# EAGLE design LoraGateway (EAGLE 9.5.1)

## Sheet 1 of 2: Baseband
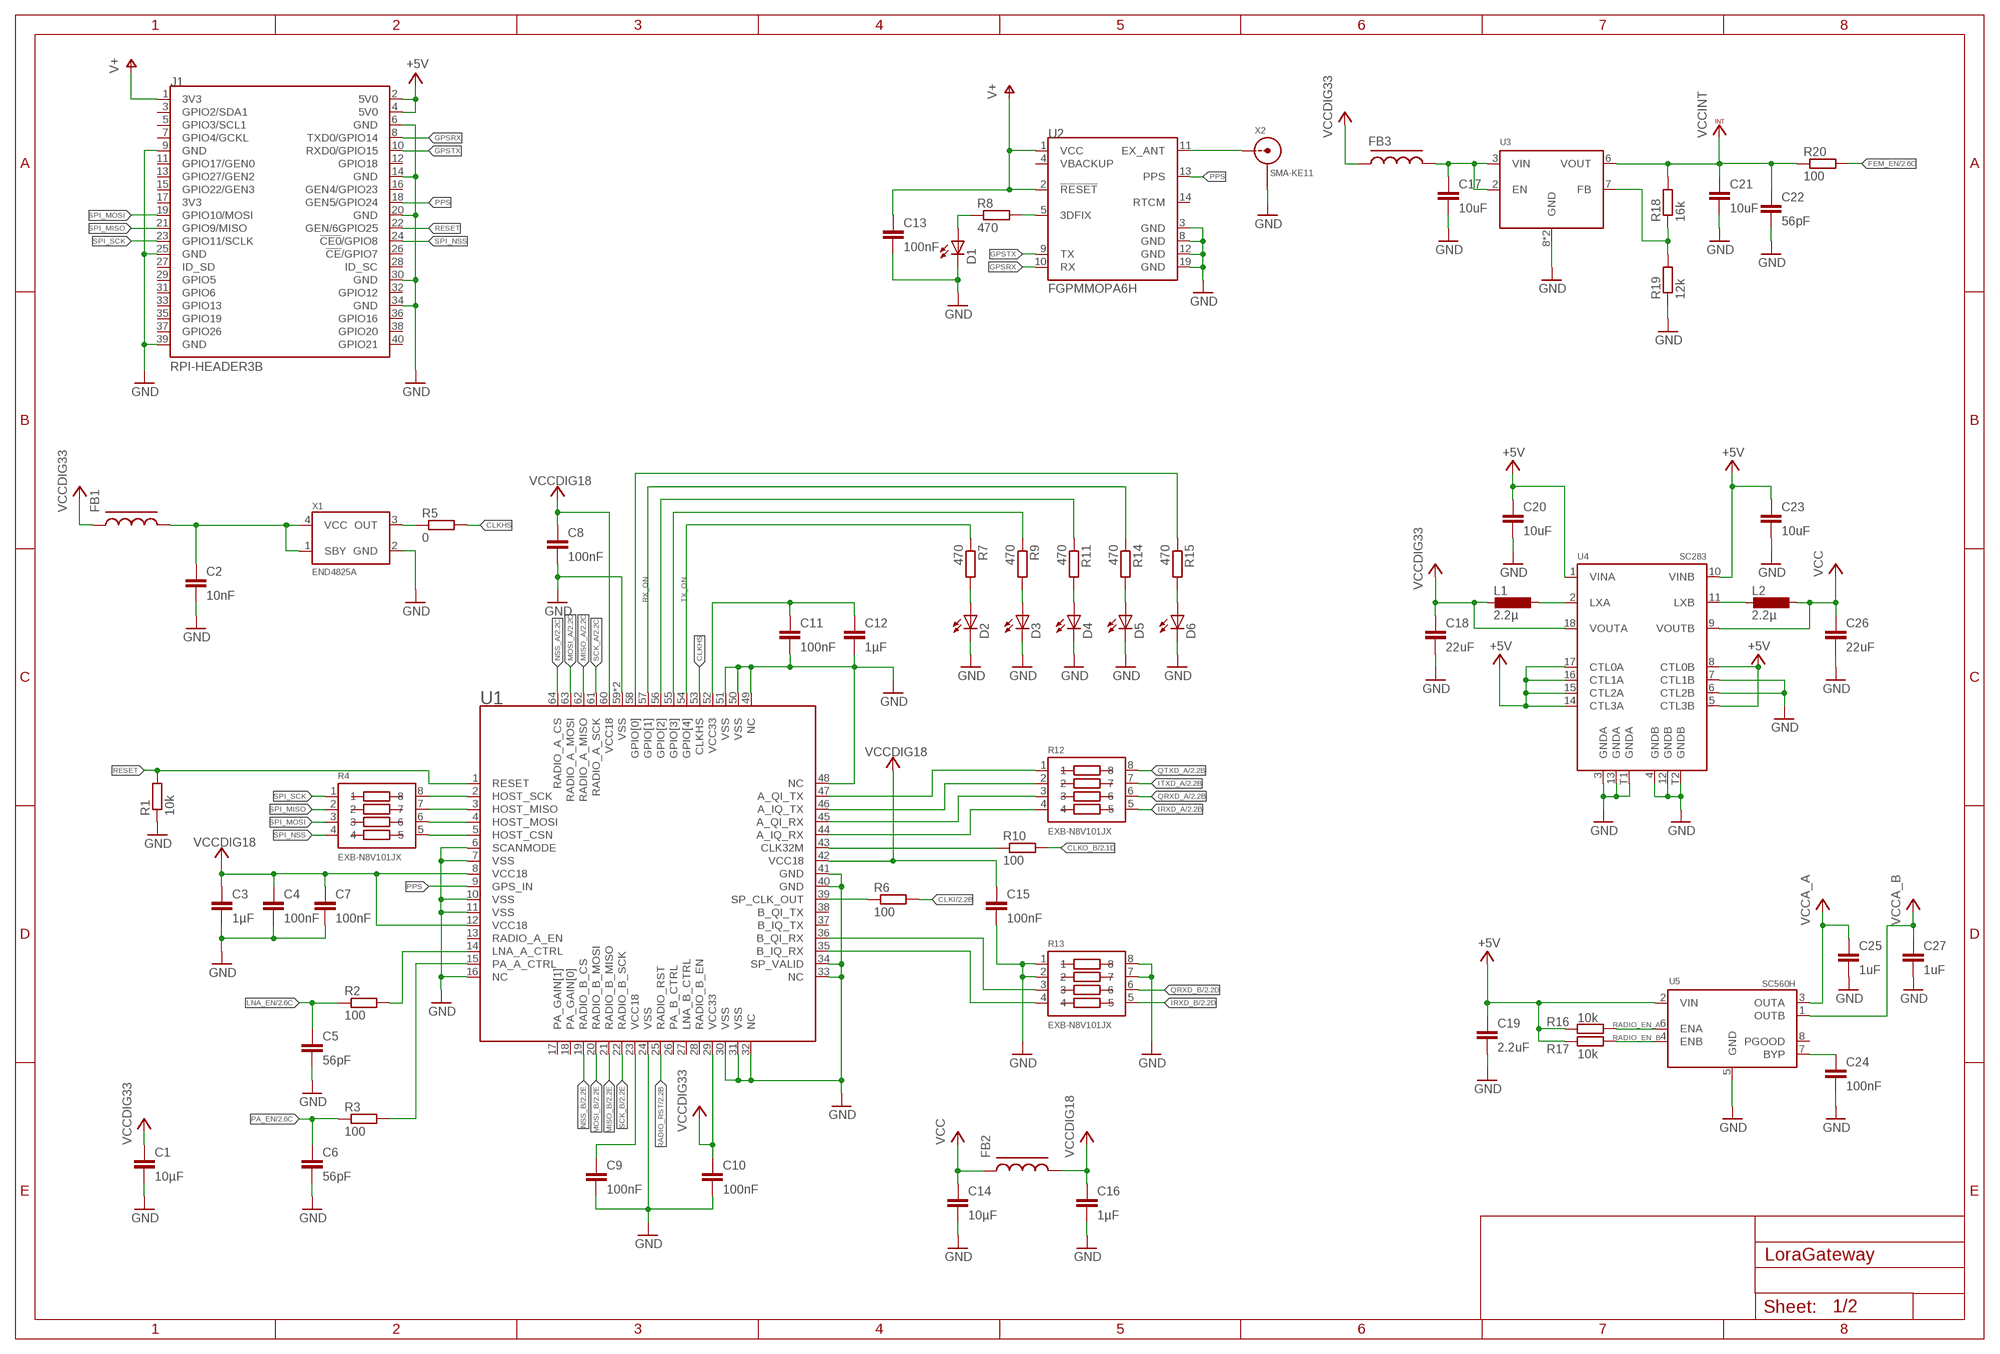
[diagram p0: schematic, sheet 1]

### Parts
C1  10µF  C-EU0805  [C0805]
C2  10nF  C-EU0402  [C0402]
C3  1µF  C-EU0402  [C0402]
C4  100nF  C-EU0402  [C0402]
C5  56pF  C-EU0402  [C0402]
C6  56pF  C-EU0402  [C0402]
C7  100nF  C-EU0402  [C0402]
C8  100nF  C-EU0402  [C0402]
C9  100nF  C-EU0402  [C0402]
C10  100nF  C-EU0402  [C0402]
C11  100nF  C-EU0402  [C0402]
C12  1µF  C-EU0402  [C0402]
C13  100nF  C-EU0402  [C0402]
C14  10µF  C-EU0805  [C0805]
C15  100nF  C-EU0402  [C0402]
C16  1µF  C-EU0603  [C0603]
C17  10uF  C-EU0805  [C0805]
C18  22uF  C-EU1206  [C1206]
C19  2.2uF  C-EU0603  [C0603]
C20  10uF  C-EU1206  [C1206]
C21  10uF  C-EU0805  [C0805]
C22  56pF  C-EU0402  [C0402]
C23  10uF  C-EU1206  [C1206]
C24  100nF  C-EUC0402  [C0402]
C25  1uF  C-EU0805  [C0805]
C26  22uF  C-EU1206  [C1206]
C27  1uF  C-EU0805  [C0805]
D1  LED  [D0603]
D2  LED  [D0603]
D3  LED  [D0603]
D4  LED  [D0603]
D5  LED  [D0603]
D6  LED  [D0603]
FB1  BLM15PG100SN1D0402  [L0402]
FB2  BLM15PG100SN1D0402  [L0402]
FB3  BLM15PG100SN1D0402  [L0402]
J1  RPI-HEADER3B  [RPI]
L1  2.2µ  ASPI-0418  [ASPI-0418]
L2  2.2µ  ASPI-0418  [ASPI-0418]
R1  10k  R-EU_R0402  [R0402]
R2  100  R-EU0402  [R0402]
R3  100  R-EU0402  [R0402]
R4  EXB-N8V101JX  [EXB28V]
R5  0  R-EU0402  [R0402]
R6  100  R-EU0402  [R0402]
R7  470  R-EU0603  [R0603]
R8  470  R-EU_R0402  [R0402]
R9  470  R-EU0603  [R0603]
R10  100  R-EU0402  [R0402]
R11  470  R-EU0603  [R0603]
R12  EXB-N8V101JX  [EXB28V]
R13  EXB-N8V101JX  [EXB28V]
R14  470  R-EU0603  [R0603]
R15  470  R-EU0603  [R0603]
R16  10k  R-EU0402  [R0402]
R17  10k  R-EU0402  [R0402]
R18  16k  R-EU0402  [R0402]
R19  12k  R-EU0402  [R0402]
R20  100  R-EU0402  [R0402]
U1  SX1308  [QFN64-9X9]
U2  FGPMMOPA6H  [FGPMMOPA6H]
U3  SC4212  [3X3MLPD-8]
U4  SC283  [2X3MLPQ-W18]
U5  SC560H  [MLPQ-UT8]
X1  END4825A  [2.5X2.0MM]
X2  SMA-KE11  [J502-ND-142-0711-871/876]

### Nets
+5V: C19.1 C20.1 C23.1 J1.2(5V0) J1.4(5V0) R16.1 R17.1 U4.1(VINA) U4.5(CTL3B) U4.8(CTL0B) U4.10(VINB) U4.14(CTL3A) U4.15(CTL2A) U4.16(CTL1A) U4.17(CTL0A) U5.2(VIN)
CLKHS: R5.2 U1.53(CLKHS)
CLKI: R6.2 ; also sheet 2
CLKO_B: R10.2 ; also sheet 2
FEM_EN: R20.2 ; also sheet 2
GND: C1.2 C2.2 C3.2 C4.2 C5.2 C6.2 C7.2 C8.2 C9.2 C10.2 C11.2 C12.2 C13.2 C14.2 C15.2 C16.2 C17.2 C18.2 C19.2 C20.2 C21.2 C22.2 C23.2 C24.2 C25.2 C26.2 C27.2 D1.C D2.C D3.C D4.C D5.C D6.C J1.6(GND) J1.9(GND) J1.14(GND) J1.20(GND) J1.25(GND) J1.30(GND) J1.34(GND) J1.39(GND) R1.1 R13.1 R13.2 R13.7 R13.8 R19.1 U1.6(SCANMODE) U1.7(VSS) U1.10(VSS) U1.11(VSS) U1.16(NC) U1.24(VSS) U1.30(VSS) U1.31(VSS) U1.32(NC) U1.33(NC) U1.34(SP_VALID) U1.40(GND) U1.41(GND) U1.48(NC) U1.49(NC) U1.50(VSS) U1.51(VSS) U1.59(VSS) U1.EXP(VSS) U2.3(GND) U2.8(GND) U2.12(GND) U2.19(GND) U3.8(GND) U3.GND U4.3(GNDA) U4.4(GNDB) U4.6(CTL2B) U4.7(CTL1B) U4.12(GNDB) U4.13(GNDA) U4.T1(GNDA) U4.T2(GNDB) U5.5(GND) X1.2(GND) X2.G@1(GND) X2.G@2(GND) X2.G@3(GND) X2.G@4(GND) ; also sheet 2
GPSRX: J1.8(TXD0/GPIO14) U2.10(RX)
GPSTX: J1.10(RXD0/GPIO15) U2.9(TX)
IRXD_A: R12.5 ; also sheet 2
IRXD_B: R13.5 ; also sheet 2
ITXD_A: R12.7 ; also sheet 2
LNA_EN: C5.1 R2.1 ; also sheet 2
MISO_A: U1.62(RADIO_A_MISO) ; also sheet 2
MISO_B: U1.21(RADIO_B_MISO) ; also sheet 2
MOSI_A: U1.63(RADIO_A_MOSI) ; also sheet 2
MOSI_B: U1.20(RADIO_B_MOSI) ; also sheet 2
N$1: L1.1 U4.2(LXA)
N$2: L2.2 U4.11(LXB)
N$3: R18.1 R19.2 U3.7(FB)
N$4: C24.1 U5.7(BYP)
N$5: R6.1 U1.39(SP_CLK_OUT)
N$7: R15.1 U1.58(GPIO[0])
N$8: R11.1 U1.56(GPIO[2])
N$10: R4.8 U1.2(HOST_SCK)
N$11: R4.7 U1.3(HOST_MISO)
N$12: C17.1 FB3.2 U3.2(EN) U3.3(VIN)
N$14: R4.6 U1.4(HOST_MOSI)
N$15: R13.3 U1.36(B_QI_RX)
N$17: R5.1 X1.3(OUT)
N$28: R2.2 U1.14(LNA_A_CTRL)
N$29: R3.2 U1.15(PA_A_CTRL)
N$33: R4.5 U1.5(HOST_CSN)
N$38: C9.1 U1.23(VCC18)
N$42: D2.A R7.2
N$45: D3.A R9.2
N$50: R13.4 U1.35(B_IQ_RX)
N$51: U2.11(EX_ANT) X2.1
N$58: R10.1 U1.43(CLK32M)
N$59: R12.4 U1.44(A_IQ_RX)
N$60: R12.3 U1.45(A_QI_RX)
N$61: R12.2 U1.46(A_IQ_TX)
N$62: R12.1 U1.47(A_QI_TX)
N$66: D4.A R11.2
N$67: C11.1 C12.1 U1.52(VCC33)
N$68: D5.A R14.2
N$69: D6.A R15.2
N$71: R9.1 U1.55(GPIO[3])
N$72: R8.2 U2.5(3DFIX)
N$76: D1.A R8.1
NSS_A: U1.64(RADIO_A_CS) ; also sheet 2
NSS_B: U1.19(RADIO_B_CS) ; also sheet 2
PA_EN: C6.1 R3.1 ; also sheet 2
PPS: J1.18(GEN5/GPIO24) U1.9(GPS_IN) U2.13(PPS)
Q1_VCC: C2.1 FB1.2 X1.1(SBY) X1.4(VCC)
QRXD_A: R12.6 ; also sheet 2
QRXD_B: R13.6 ; also sheet 2
QTXD_A: R12.8 ; also sheet 2
RADIO_EN_A: R16.2 U5.6(ENA)
RADIO_EN_B: R17.2 U5.4(ENB)
RADIO_RST: U1.25(RADIO_RST) ; also sheet 2
RESET: J1.22(GEN/6GPIO25) R1.2 U1.1(RESET)
RX_ON: R14.1 U1.57(GPIO[1])
SCK_A: U1.61(RADIO_A_SCK) ; also sheet 2
SCK_B: U1.22(RADIO_B_SCK) ; also sheet 2
SPI_MISO: J1.21(GPIO9/MISO) R4.2
SPI_MOSI: J1.19(GPIO10/MOSI) R4.3
SPI_NSS: J1.24(!CE0!/GPIO8) R4.4
SPI_SCK: J1.23(GPIO11/SCLK) R4.1
TX_ON: R7.1 U1.54(GPIO[4])
V+: C13.1 J1.1(3V3) U2.1(VCC) U2.2(!RESET)
VCC: C14.1 C26.1 FB2.1 L2.1 U4.9(VOUTB)
VCCA_A: C25.1 U5.3(OUTA) ; also sheet 2
VCCA_B: C27.1 U5.1(OUTB) ; also sheet 2
VCCDIG18: C3.1 C4.1 C7.1 C8.1 C15.1 C16.1 FB2.2 U1.8(VCC18) U1.12(VCC18) U1.42(VCC18) U1.60(VCC18)
VCCDIG33: C1.1 C10.1 C18.1 FB1.1 FB3.1 L1.2 U1.29(VCC33) U4.18(VOUTA)
VCCINT: C21.1 C22.1 R18.2 R20.1 U3.6(VOUT) ; also sheet 2
Unconnected: J1.3(GPIO2/SDA1) J1.5(GPIO3/SCL1) J1.7(GPIO4/GCKL) J1.11(GPIO17/GEN0) J1.12(GPIO18) J1.13(GPIO27/GEN2) J1.15(GPIO22/GEN3) J1.16(GEN4/GPIO23) J1.17(3V3) J1.26(!CE!/GPIO7) J1.27(ID_SD) J1.28(ID_SC) J1.29(GPIO5) J1.31(GPIO6) J1.32(GPIO12) J1.33(GPIO13) J1.35(GPIO19) J1.36(GPIO16) J1.37(GPIO26) J1.38(GPIO20) J1.40(GPIO21) U1.13(RADIO_A_EN) U1.17(PA_GAIN[1]) U1.18(PA_GAIN[0]) U1.26(PA_B_CTRL) U1.27(LNA_B_CTRL) U1.28(RADIO_B_EN) U1.37(B_IQ_TX) U1.38(B_QI_TX) U2.4(VBACKUP) U2.14(RTCM) U5.8(PGOOD)

## Sheet 2 of 2: HF Frontends
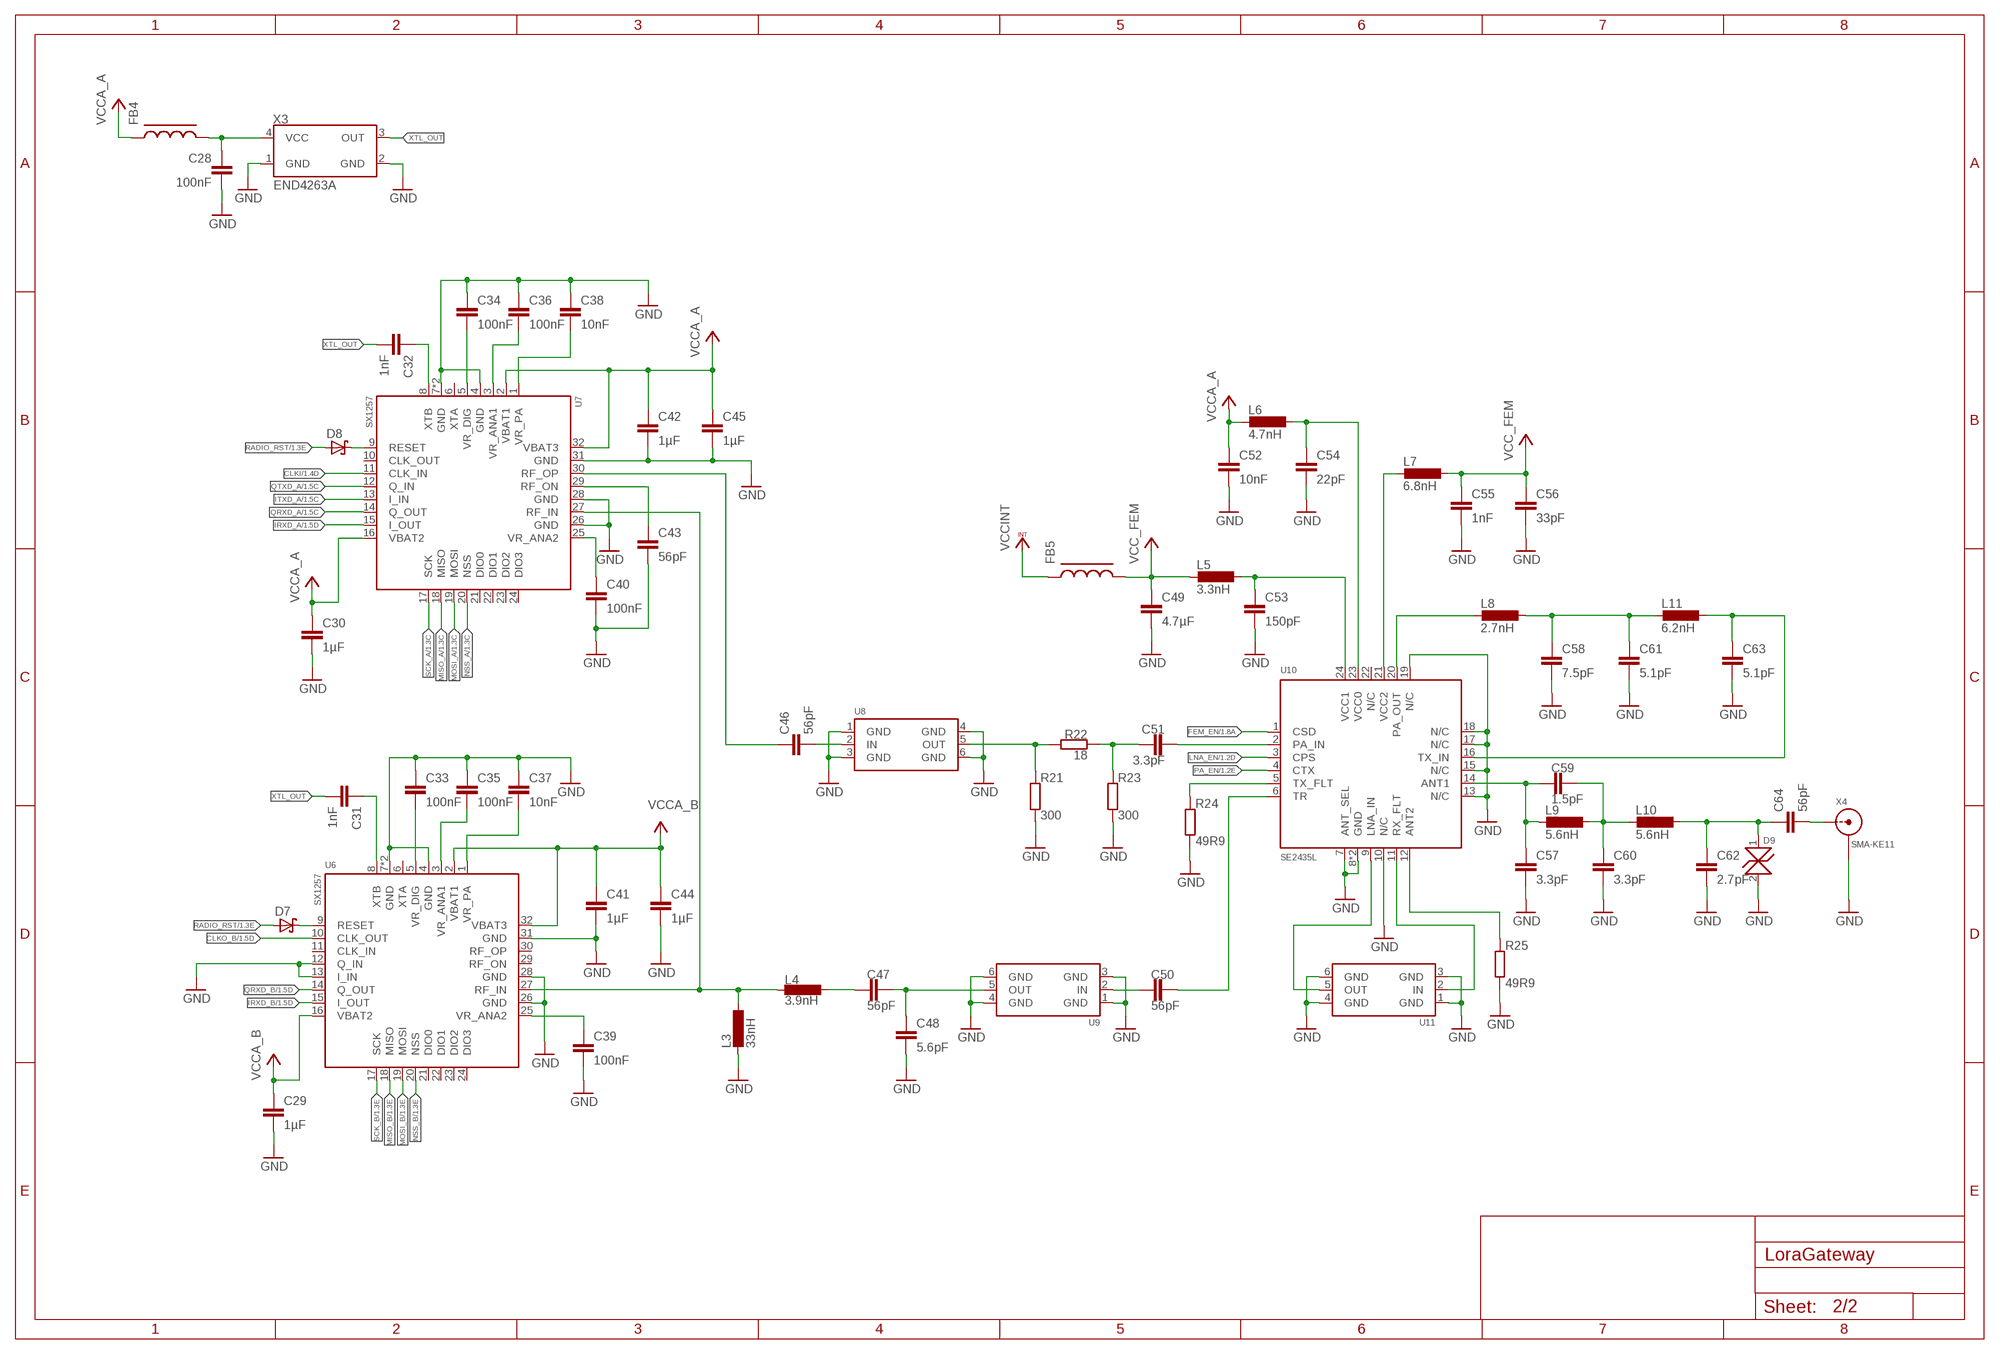
[diagram p1: schematic, sheet 2]

### Parts
C28  100nF  C-EU0402  [C0402]
C29  1µF  C-EU0402  [C0402]
C30  1µF  C-EU0402  [C0402]
C31  1nF  C-EU0402  [C0402]
C32  1nF  C-EU0402  [C0402]
C33  100nF  C-EU0402  [C0402]
C34  100nF  C-EU0402  [C0402]
C35  100nF  C-EU0402  [C0402]
C36  100nF  C-EU0402  [C0402]
C37  10nF  C-EU0402  [C0402]
C38  10nF  C-EU0402  [C0402]
C39  100nF  C-EU0402  [C0402]
C40  100nF  C-EU0402  [C0402]
C41  1µF  C-EU0402  [C0402]
C42  1µF  C-EU0402  [C0402]
C43  56pF  C-EU0402  [C0402]
C44  1µF  C-EU0402  [C0402]
C45  1µF  C-EU0402  [C0402]
C46  56pF  C-EU0402  [C0402]
C47  56pF  C-EU0402  [C0402]
C48  5.6pF  C-EU0402  [C0402]
C49  4.7µF  C-EU0603  [C0603]
C50  56pF  C-EU0402  [C0402]
C51  3.3pF  C-EU0402  [C0402]
C52  10nF  C-EU0402  [C0402]
C53  150pF  C-EU0402  [C0402]
C54  22pF  C-EU0402  [C0402]
C55  1nF  C-EU0402  [C0402]
C56  33pF  C-EU0402  [C0402]
C57  3.3pF  C-EU0402  [C0402]
C58  7.5pF  C-EU0402  [C0402]
C59  1.5pF  C-EU0402  [C0402]
C60  3.3pF  C-EU0402  [C0402]
C61  5.1pF  C-EU0402  [C0402]
C62  2.7pF  C-EU0402  [C0402]
C63  5.1pF  C-EU0402  [C0402]
C64  56pF  C-EU0402  [C0402]
D7  BAT54XV2T1G  [SOD523]
D8  BAT54XV2T1G  [SOD523]
D9  LXES15AAA1-153  [LXES15AAA1-153]
FB4  BLM15PG100SN1D0402  [L0402]
FB5  BLM18PG121SH1D  [L0603]
L3  33nH  L-EU0402  [L0402]
L4  3.9nH  L-EU0402  [L0402]
L5  3.3nH  L-EU0402  [L0402]
L6  4.7nH  L-EU0402  [L0402]
L7  6.8nH  L-EU0402  [L0402]
L8  2.7nH  L-EU0402  [L0402]
L9  5.6nH  L-EU0402  [L0402]
L10  5.6nH  L-EU0402  [L0402]
L11  6.2nH  L-EU0402  [L0402]
R21  300  R-EU0402  [R0402]
R22  18  R-EU0402  [R0402]
R23  300  R-EU0402  [R0402]
R24  49R9  R-EU0402  [R0402]
R25  49R9  R-EU0402  [R0402]
U6  SX1257  [QFN32]
U7  SX1257  [QFN32]
U8  B39871B3717U410  [DCC6C-3X3]
U9  B39871B3717U410  [DCC6C-3X3]
U10  SE2435L  [VQFN24-4X4]
U11  B39871B3717U410  [DCC6C-3X3]
X3  END4263A  [2.0X1.6MM]
X4  SMA-KE11  [J502-ND-142-0711-871/876]

### Nets
CLKI: U7.11(CLK_IN) ; also sheet 1
CLKO_B: U6.10(CLK_OUT) ; also sheet 1
FEM_EN: U10.1(CSD) ; also sheet 1
GND: C28.2 C29.2 C30.2 C33.1 C34.1 C35.1 C36.1 C37.1 C38.1 C39.2 C40.2 C41.2 C42.2 C43.2 C44.2 C45.2 C48.2 C49.2 C52.2 C53.2 C54.2 C55.2 C56.2 C57.2 C58.2 C60.2 C61.2 C62.2 C63.2 D9.2 L3.2 R21.2 R23.2 R24.1 R25.1 U6.4(GND) U6.7(GND) U6.12(Q_IN) U6.13(I_IN) U6.26(GND) U6.28(GND) U6.31(GND) U6.EXP(GND) U7.4(GND) U7.7(GND) U7.26(GND) U7.28(GND) U7.31(GND) U7.EXP(GND) U8.1(GND) U8.3(GND) U8.4(GND) U8.6(GND) U9.1(GND) U9.3(GND) U9.4(GND) U9.6(GND) U10.7(ANT_SEL) U10.8(GND) U10.10(N/C) U10.13(N/C) U10.15(N/C) U10.17(N/C) U10.18(N/C) U10.19(N/C) U10.GND U11.1(GND) U11.3(GND) U11.4(GND) U11.6(GND) X3.1(GND) X3.2(GND) X4.G@1(GND) X4.G@2(GND) X4.G@3(GND) X4.G@4(GND) ; also sheet 1
IRXD_A: U7.15(I_OUT) ; also sheet 1
IRXD_B: U6.15(I_OUT) ; also sheet 1
ITXD_A: U7.13(I_IN) ; also sheet 1
LNA_EN: U10.3(CPS) ; also sheet 1
MISO_A: U7.18(MISO) ; also sheet 1
MISO_B: U6.18(MISO) ; also sheet 1
MOSI_A: U7.19(MOSI) ; also sheet 1
MOSI_B: U6.19(MOSI) ; also sheet 1
N$13: C40.1 U7.25(VR_ANA2)
N$18: C28.1 FB4.2 X3.4(VCC)
N$19: R25.2 U10.12(ANT2)
N$20: U10.9(LNA_IN) U11.5(OUT)
N$21: U10.11(RX_FLT) U11.2(IN)
N$22: R24.2 U10.5(TX_FLT)
N$23: C54.1 L6.1 U10.23(VCC0)
N$24: C58.1 C61.1 L8.1 L11.2
N$25: C53.1 L5.1 U10.24(VCC1)
N$26: L7.2 U10.21(VCC2)
N$27: C59.2 C60.1 L9.1 L10.2
N$30: L8.2 U10.20(PA_OUT)
N$31: C63.1 L11.1 U10.16(TX_IN)
N$32: C57.1 C59.1 L9.2 U10.14(ANT1)
N$34: C62.1 C64.1 D9.1 L10.1
N$35: C51.1 U10.2(PA_IN)
N$36: C50.2 U10.6(TR)
N$37: C51.2 R22.1 R23.1
N$39: R21.1 R22.2 U8.5(OUT)
N$40: C46.2 U8.2(IN)
N$41: C50.1 U9.2(IN)
N$43: C47.2 C48.1 U9.5(OUT)
N$44: C47.1 L4.1
N$46: C46.1 U7.30(RF_OP)
N$47: C39.1 U6.25(VR_ANA2)
N$48: D7.C U6.9(RESET)
N$49: C31.1 U6.8(XTB)
N$52: C32.1 U7.8(XTB)
N$53: C38.2 U7.1(VR_PA)
N$54: C37.2 U6.1(VR_PA)
N$55: C35.2 U6.3(VR_ANA1)
N$56: C33.2 U6.5(VR_DIG)
N$57: C36.2 U7.3(VR_ANA1)
N$63: C34.2 U7.5(VR_DIG)
N$64: C43.1 U7.29(RF_ON)
N$65: C64.2 X4.1
N$70: D8.C U7.9(RESET)
NSS_A: U7.20(NSS) ; also sheet 1
NSS_B: U6.20(NSS) ; also sheet 1
PA_EN: U10.4(CTX) ; also sheet 1
QRXD_A: U7.14(Q_OUT) ; also sheet 1
QRXD_B: U6.14(Q_OUT) ; also sheet 1
QTXD_A: U7.12(Q_IN) ; also sheet 1
RADIO_RST: D7.A D8.A ; also sheet 1
RF_IN: L3.1 L4.2 U6.27(RF_IN) U7.27(RF_IN)
SCK_A: U7.17(SCK) ; also sheet 1
SCK_B: U6.17(SCK) ; also sheet 1
VCC_FEM: C49.1 C55.1 C56.1 FB5.2 L5.2 L7.1
VCCA_A: C30.1 C42.1 C45.1 C52.1 FB4.1 L6.2 U7.2(VBAT1) U7.16(VBAT2) U7.32(VBAT3) ; also sheet 1
VCCA_B: C29.1 C41.1 C44.1 U6.2(VBAT1) U6.16(VBAT2) U6.32(VBAT3) ; also sheet 1
VCCINT: FB5.1 ; also sheet 1
XTL_OUT: C31.2 C32.2 X3.3(OUT)
Unconnected: U6.6(XTA) U6.11(CLK_IN) U6.21(DIO0) U6.22(DIO1) U6.23(DIO2) U6.24(DIO3) U6.29(RF_ON) U6.30(RF_OP) U7.6(XTA) U7.10(CLK_OUT) U7.21(DIO0) U7.22(DIO1) U7.23(DIO2) U7.24(DIO3) U10.22(N/C)

## Library data of the parts
C1 C14 C17 C21 = common:C-EU; OC_DIGIKEY: 1276-2399-1-ND
C2 C37 C38 C52 = common:C-EU; OC_DIGIKEY: 478-7867-1-ND
C3 C12 C29 C30 C41 C42 C44 C45 = common:C-EU; OC_DIGIKEY: 1276-1076-1-ND
C4 C7-C11 C13 C15 C28 C33-C36 C39 C40 = common:C-EU; OC_DIGIKEY: 478-7888-1-ND
C5 C6 C22 C43 C46 C47 C50 C64 = common:C-EU; OC_DIGIKEY: 490-1288-1-ND
C16 = common:C-EU; OC_DIGIKEY: 490-1543-1-ND
C18 C26 = common:C-EU; OC_DIGIKEY: 445-6001-1-ND
C19 = common:C-EU; OC_DIGIKEY: 1276-1878-1-ND
C20 C23 = common:C-EU; OC_DIGIKEY: 490-5525-1-ND
C24 = rcl:C-EU: CAPACITOR, European symbol; OC_DIGIKEY: 478-7888-1-ND; SPICEPREFIX: C
C25 C27 = common:C-EU; OC_DIGIKEY: 490-1691-1-ND
C31 C32 C55 = common:C-EU; OC_DIGIKEY: 490-6348-1-ND
C48 = common:C-EU; OC_DIGIKEY: 490-6250-1-ND
C49 = common:C-EU; OC_DIGIKEY: 1276-1905-1-ND
C51 C57 C60 = common:C-EU; OC_DIGIKEY: 490-6238-1-ND
C53 = common:C-EU; OC_DIGIKEY: 311-1025-1-ND
C54 = common:C-EU; OC_DIGIKEY: 490-11382-1-ND
C56 = common:C-EU; OC_DIGIKEY: 490-5936-1-ND
C58 = common:C-EU; OC_DIGIKEY: 490-8227-1-ND
C59 = common:C-EU; OC_DIGIKEY: 490-6212-1-ND
C61 C63 = common:C-EU; OC_DIGIKEY: 490-8215-1-ND
C62 = common:C-EU; OC_DIGIKEY: 490-6229-1-ND
D1-D6 = common:LED; OC_DIGIKEY: 160-1463-1-ND
D7 D8 = LoRa Gateway:BAT54XV2T1G; OC_DIGIKEY: BAT54XV2T1GOSCT-ND
D9 = LoRa Gateway:LXES15AAA1-153; OC_DIGIKEY: 490-13210-1-ND
FB1-FB4 = LoRa Gateway:BLM15PG100SN1D; OC_DIGIKEY: 490-5976-1-ND
FB5 = LoRa Gateway:BLM18PG121SH1D; OC_DIGIKEY: 490-7815-1-ND
J1 = LoRa Gateway:RPI-HEADER: Raspberry Pi Zero for SPEAKER ON
L1 L2 = LoRa Gateway:ASPI-0418; OC_DIGIKEY: 535-10759-1-ND
L3 = common:L-EU; OC_DIGIKEY: 490-1152-1-ND
L4 = common:L-EU; OC_DIGIKEY: 490-6815-1-ND
L5 = common:L-EU; OC_DIGIKEY: 490-6809-1-ND
L6 = common:L-EU; OC_DIGIKEY: 490-1139-1-ND
L7 = common:L-EU; OC_DIGIKEY: 490-1142-1-ND
L8 = common:L-EU; OC_DIGIKEY: 490-1137-1-ND
L9 L10 = common:L-EU; OC_DIGIKEY: 490-6834-1-ND
L11 = common:L-EU; OC_DIGIKEY: 490-1141-1-ND
R1 = rcl:R-EU_: RESISTOR, European symbol; OC_DIGIKEY: 541-10KJCT-ND; SPICEPREFIX: R
R2 R3 R6 R10 R20 = common:R-EU; OC_DIGIKEY: 541-100ATCT-ND
R4 R12 R13 = LoRa Gateway:EXB-N8V101JX; OC_DIGIKEY: Y10101CT-ND
R5 = common:R-EU; OC_DIGIKEY: 541-4062-1-ND
R7 R9 R11 R14 R15 = common:R-EU; OC_DIGIKEY: 311-470GRCT-ND
R8 = rcl:R-EU_: RESISTOR, European symbol; OC_DIGIKEY: 311-470JRCT-ND; SPICEPREFIX: R
R16 R18 R19 = common:R-EU; OC_DIGIKEY: 541-10KJCT-ND
R17 = common:R-EU; OC_DIGIKEY: 311-100KJRCT-ND
R21 R23 = common:R-EU; OC_DIGIKEY: RMCF0402FT300RCT-ND
R22 = common:R-EU; OC_DIGIKEY: A129606CT-ND
R24 R25 = common:R-EU; OC_DIGIKEY: 541-3967-1-ND
U1 = LoRa Gateway:SX1308; OC_DIGIKEY: SX1308IMLTRTCT-ND
U2 = LoRa Gateway:FGPMMOPA6H
U3 = LoRa Gateway:SC4212
U4 = LoRa Gateway:SC283; OC_DIGIKEY: SC283WLCT-ND
U5 = LoRa Gateway:SC560H; OC_DIGIKEY: SC560HULCT-ND
U6 U7 = LoRa Gateway:SX1257; OC_DIGIKEY: SX1257IWLTRTCT-ND
U8 U9 U11 = LoRa Gateway:B39871B3717U410; OC_DIGIKEY: 495-3734-1-ND
U10 = LoRa Gateway:SE2435L; OC_DIGIKEY: 863-1349-1-ND
X1 = LoRa Gateway:END4825A; OC_DIGIKEY: 644-1329-1-ND
X2 X4 = LoRa Gateway:SMA-KE11; OC_DIGIKEY: 931-1175-ND
X3 = LoRa Gateway:END4263A; OC_DIGIKEY: 644-1328-1-ND

## Net classes
0 default: width 0.2 mm

## Board
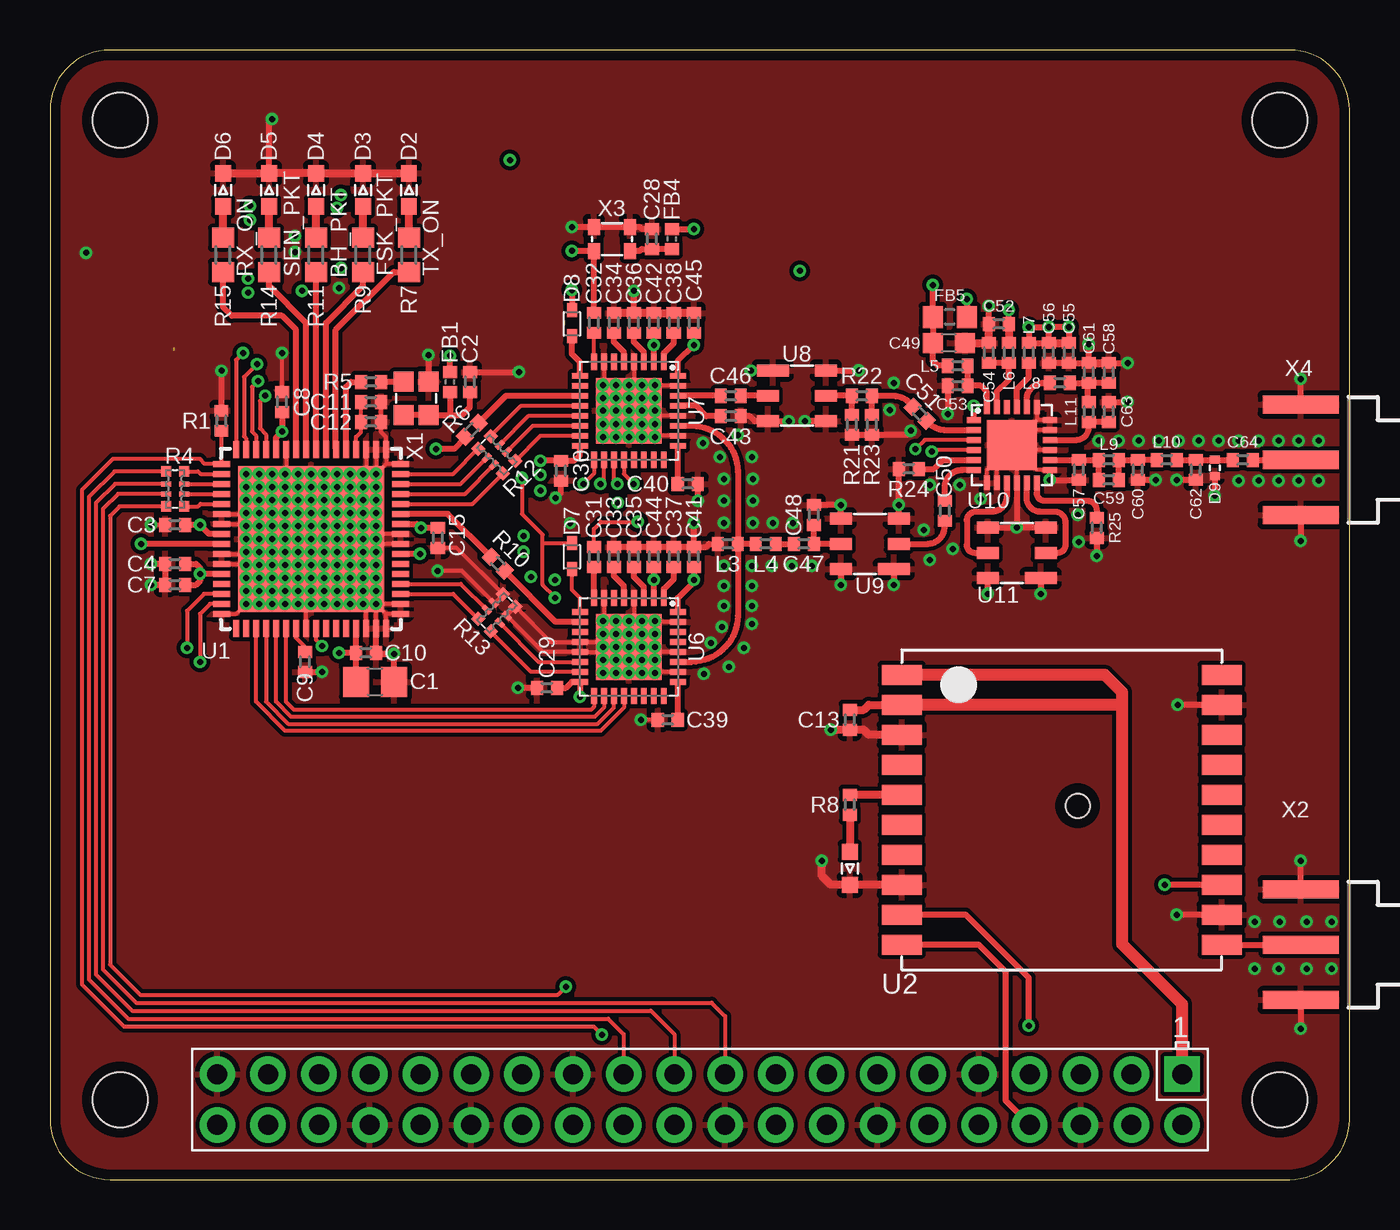
[diagram p2: board, top side]
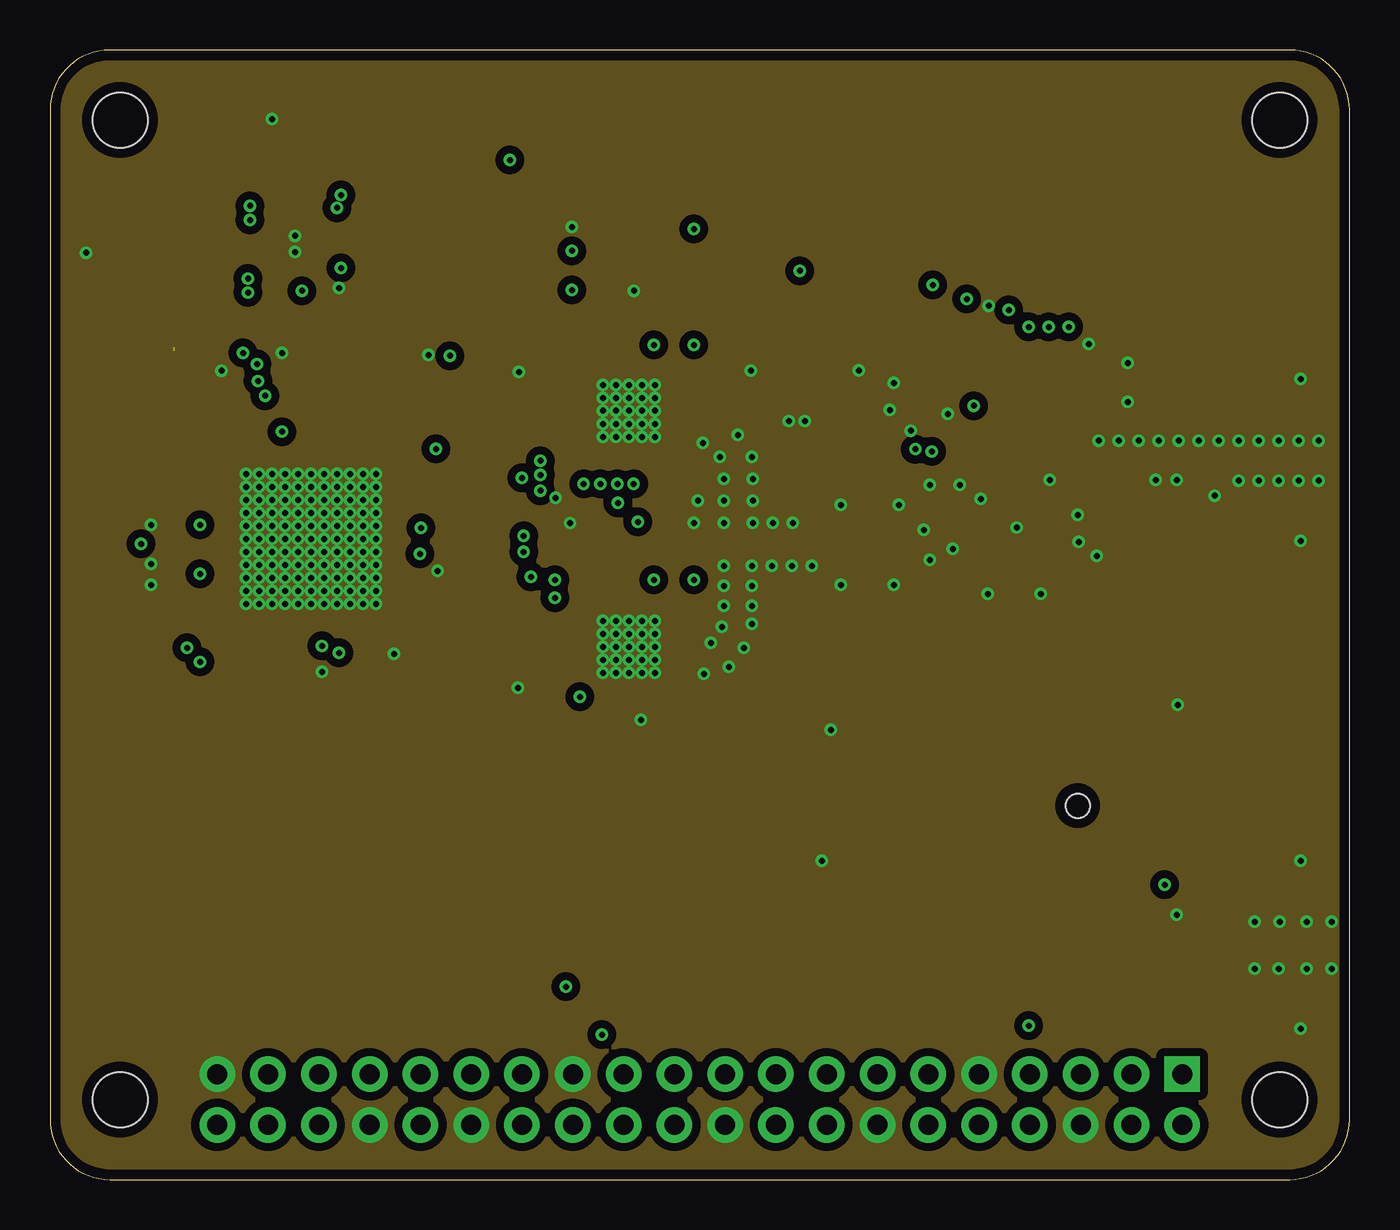
[diagram p3: board, inner layer GND]
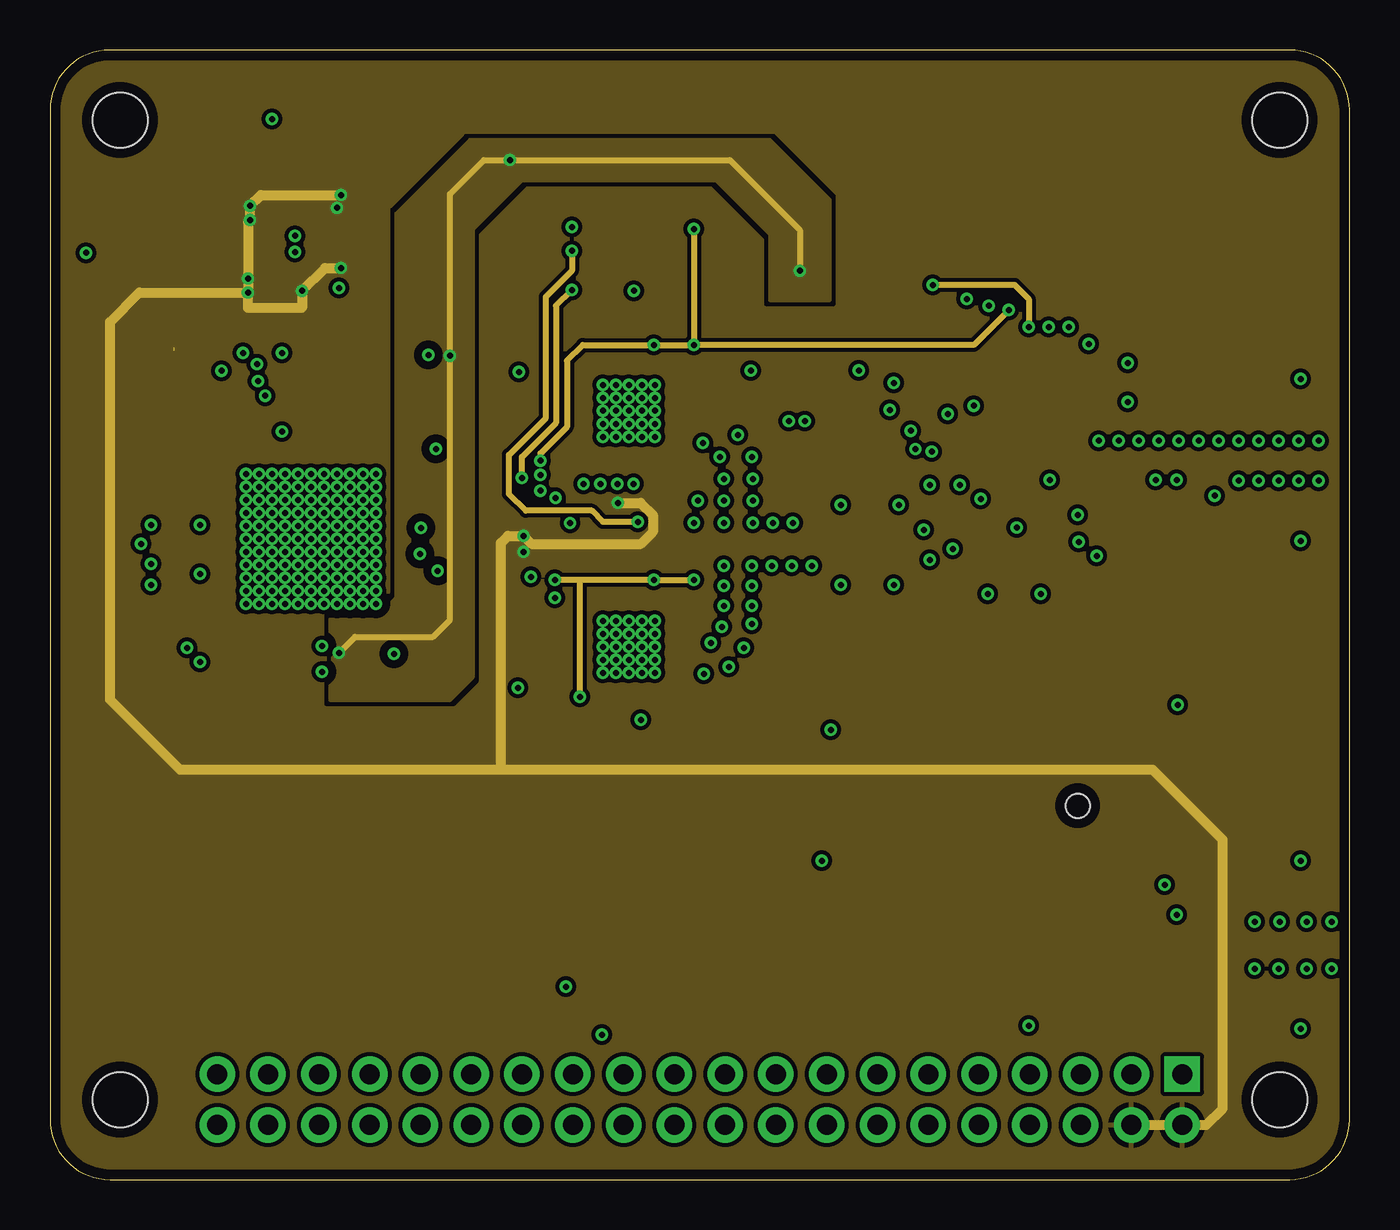
[diagram p4: board, inner layer PWR]
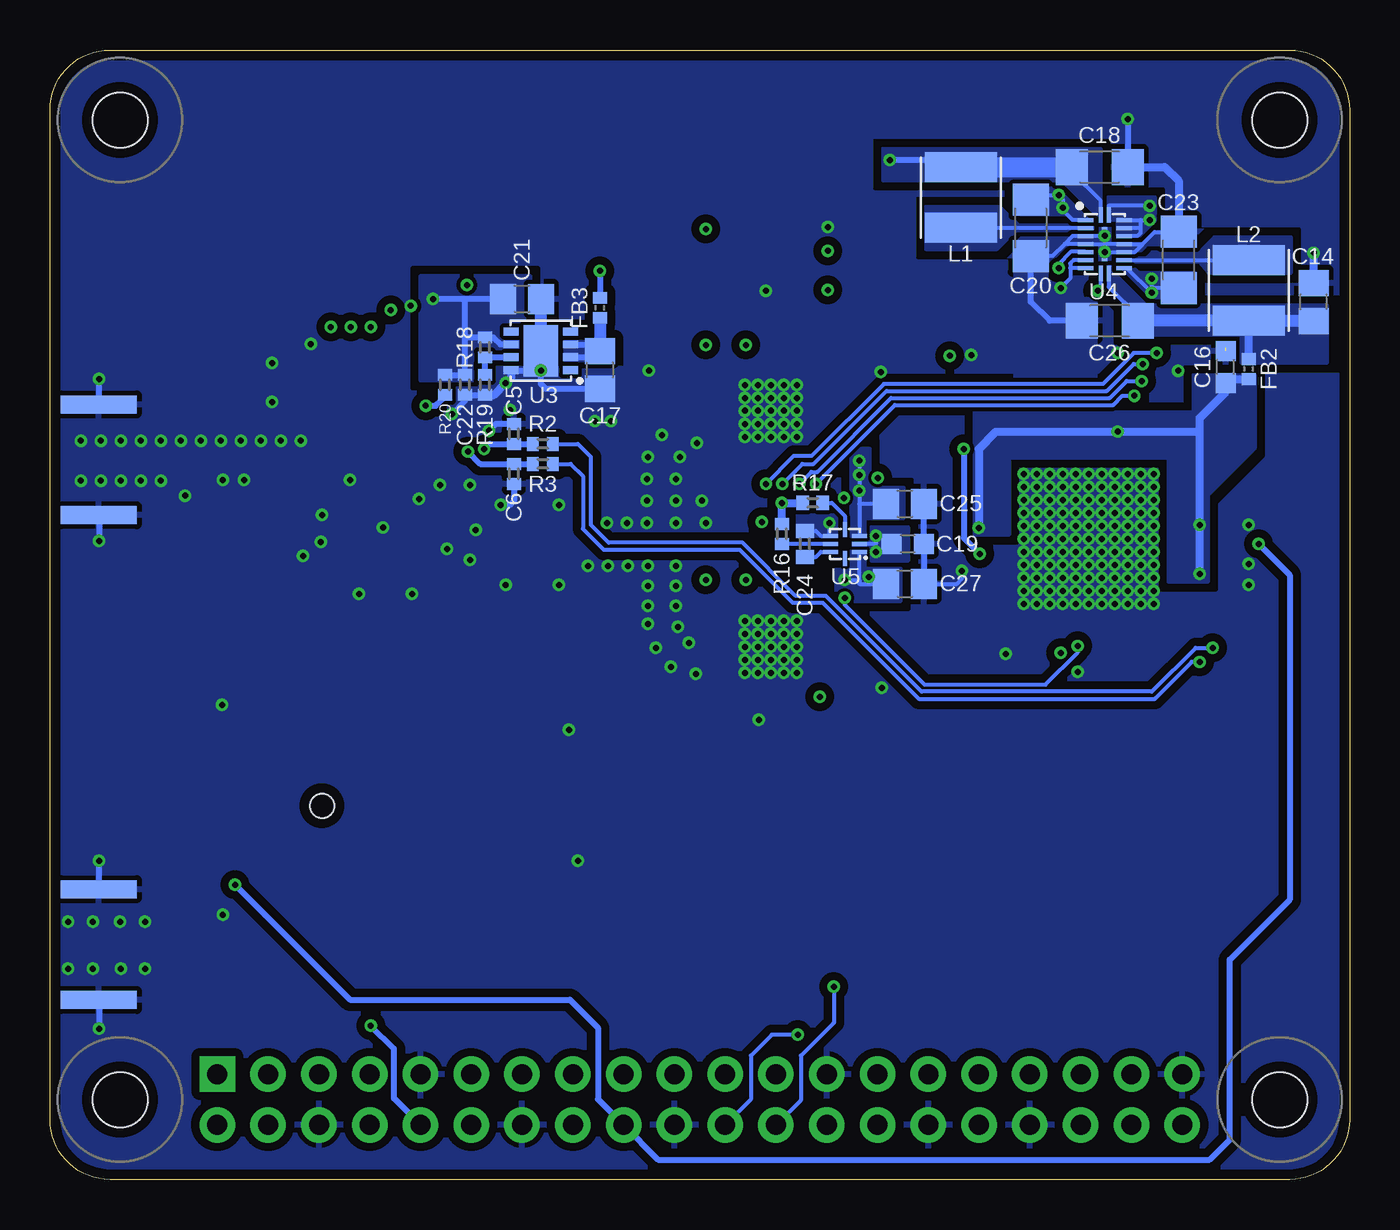
[diagram p5: board, bottom side, seen from below]

Size 65 x 56.5 mm. Coordinates in mm from the lower left corner, seen from the top.
Outline: 0,53.5 0,3 arc90 3,0 62,0 arc90 65,3 65,53.5 arc90 62,56.5 3,56.5 arc90 0,53.5
Copper layers (1+2*15+16): Top 0.035mm / dielectric 0.2mm / GND 0.0175mm / dielectric 1.065mm / PWR 0.0175mm / dielectric 0.2mm / Bottom 0.035mm
Design rules "jlcPCB-4Layer *": minimum track width 6mil, minimum drill 0.3mm, track to track 6mil, track to pad 6mil, pad to pad 6mil, via to via 8mil, smd to smd 0mil, copper to edge 20mil, drill to drill 10mil, minimum pad ring 6mil, minimum via ring 6mil, stop-mask expansion 0mil, vias tented up to drill 100mil, thermal gap 10mil

### Footprints (pad centres in the part's own frame; a part is rotated, then mirrored left to right if it is on the bottom)
C0805 = smd 1.3 x 1.5: 1 -0.95,0; 2 0.95,0
C0402 = smd 0.6 x 0.7: 1 -0.5,0; 2 0.5,0
C0603 = smd 1 x 1: 1 -0.8,0; 2 0.8,0
C1206 = smd 1.6 x 1.8: 1 -1.4,0; 2 1.4,0
C0402' = smd 0.7 x 0.9: 1 -0.65,0; 2 0.65,0
D0603 = smd 0.8 x 0.8: A -0.825,0; C 0.825,0
SOD523 = smd 0.7 x 0.5: A 0.7,0; C -0.6,0
LXES15AAA1-153 = smd 0.4 x 0.5: 1 -0.4,0; 2 0.4,0
L0402 = smd 0.6 x 0.7: 1 -0.5,0; 2 0.5,0
L0603 = smd 1 x 1.1: 1 -0.85,0; 2 0.85,0
RPI = drill 1 pad 1.778 square: 1 8.37,51.23 | drill 1 pad 1.778: 2 8.37,53.77; 3 10.91,51.23; 4 10.91,53.77; 5 13.45,51.23; 6 13.45,53.77; 7 15.99,51.23; 8 15.99,53.77; 9 18.53,51.23; 10 18.53,53.77; 11 21.07,51.23; 12 21.07,53.77; 13 23.61,51.23; 14 23.61,53.77; 15 26.15,51.23; 16 26.15,53.77; 17 28.69,51.23; 18 28.69,53.77; 19 31.23,51.23; 20 31.23,53.77; 21 33.77,51.23; 22 33.77,53.77; 23 36.31,51.23; 24 36.31,53.77; 25 38.85,51.23; 26 38.85,53.77; 27 41.39,51.23; 28 41.39,53.77; 29 43.93,51.23; 30 43.93,53.77; 31 46.47,51.23; 32 46.47,53.77; 33 49.01,51.23; 34 49.01,53.77; 35 51.55,51.23; 36 51.55,53.77; 37 54.09,51.23; 38 54.09,53.77; 39 56.63,51.23; 40 56.63,53.77 | hole 2.75: 3.5,3.5; 61.5,3.5; 3.5,52.5; 61.5,52.5
ASPI-0418 = smd 1.5 x 3.6: 1 -1.525,0; 2 1.525,0
R0402 = smd 0.6 x 0.7: 1 -0.5,0; 2 0.5,0
EXB28V = smd 0.525 x 0.5: 1 -0.875,-0.45; 4 0.875,-0.45; 5 0.875,0.45; 8 -0.875,0.45 | smd 0.25 x 0.5: 2 -0.25,-0.45; 3 0.25,-0.45; 6 0.25,0.45; 7 -0.25,0.45
R0603 = smd 1 x 1.1: 1 -0.85,0; 2 0.85,0
QFN64-9X9 = smd 0.85 x 0.3: 1 -4.475,3.75; 2 -4.475,3.25; 3 -4.475,2.75; 4 -4.475,2.25; 5 -4.475,1.75; 6 -4.475,1.25; 7 -4.475,0.75; 8 -4.475,0.25; 9 -4.475,-0.25; 10 -4.475,-0.75; 11 -4.475,-1.25; 12 -4.475,-1.75; 13 -4.475,-2.25; 14 -4.475,-2.75; 15 -4.475,-3.25; 16 -4.475,-3.75; 33 4.475,-3.75; 34 4.475,-3.25; 35 4.475,-2.75; 36 4.475,-2.25; 37 4.475,-1.75; 38 4.475,-1.25; 39 4.475,-0.75; 40 4.475,-0.25; 41 4.475,0.25; 42 4.475,0.75; 43 4.475,1.25; 44 4.475,1.75; 45 4.475,2.25; 46 4.475,2.75; 47 4.475,3.25; 48 4.475,3.75 | smd 0.3 x 0.85: 17 -3.75,-4.475; 18 -3.25,-4.475; 19 -2.75,-4.475; 20 -2.25,-4.475; 21 -1.75,-4.475; 22 -1.25,-4.475; 23 -0.75,-4.475; 24 -0.25,-4.475; 25 0.25,-4.475; 26 0.75,-4.475; 27 1.25,-4.475; 28 1.75,-4.475; 29 2.25,-4.475; 30 2.75,-4.475; 31 3.25,-4.475; 32 3.75,-4.475; 49 3.75,4.475; 50 3.25,4.475; 51 2.75,4.475; 52 2.25,4.475; 53 1.75,4.475; 54 1.25,4.475; 55 0.75,4.475; 56 0.25,4.475; 57 -0.25,4.475; 58 -0.75,4.475; 59 -1.25,4.475; 60 -1.75,4.475; 61 -2.25,4.475; 62 -2.75,4.475; 63 -3.25,4.475; 64 -3.75,4.475 | smd 7.3 x 7.3: EXP 0,0
FGPMMOPA6H = smd 2 x 1: 1 -8,6.75; 2 -8,5.25; 3 -8,3.75; 4 -8,2.25; 5 -8,0.75; 6 -8,-0.75; 7 -8,-2.25; 8 -8,-3.75; 9 -8,-5.25; 10 -8,-6.75; 11 8,-6.75; 12 8,-5.25; 13 8,-3.75; 14 8,-2.25; 15 8,-0.75; 16 8,0.75; 17 8,2.25; 18 8,3.75; 19 8,5.25; 20 8,6.75 | hole 1.2: 0.8,0.2
3X3MLPD-8 = smd 0.4 x 0.75: 1 -0.975,-1.475; 2 -0.325,-1.475; 3 0.325,-1.475; 4 0.975,-1.475; 5 0.975,1.475; 6 0.325,1.475; 7 -0.325,1.475; 8 -0.975,1.475 | smd 2.58 x 1.7: GND 0,0
2X3MLPQ-W18 = smd 0.775 x 0.2: 1 -0.963,1.2; 2 -0.963,0.8; 3 -0.963,0.4; 4 -0.963,0; 5 -0.963,-0.4; 6 -0.963,-0.8; 7 -0.963,-1.2; 10 0.963,-1.2; 11 0.963,-0.8; 12 0.963,-0.4; 13 0.963,0; 14 0.963,0.4; 15 0.963,0.8; 16 0.963,1.2 | smd 0.2 x 0.775: 8 -0.2,-1.462; 9 0.2,-1.462; 17 0.2,1.462; 18 -0.2,1.462 | smd 0.286 x 0.7: T1 0,0.5; T2 0,-0.5
MLPQ-UT8 = smd 0.75 x 0.2: 1 -0.725,0.4; 2 -0.725,0; 3 -0.725,-0.4; 5 0.725,-0.4; 6 0.725,0; 7 0.725,0.4 | smd 0.2 x 0.75: 4 0,-0.725; 8 0,0.725
QFN32 = smd 0.8 x 0.3: 1 -2.45,1.75; 2 -2.45,1.25; 3 -2.45,0.75; 4 -2.45,0.25; 5 -2.45,-0.25; 6 -2.45,-0.75; 7 -2.45,-1.25; 8 -2.45,-1.75; 17 2.45,-1.75; 18 2.45,-1.25; 19 2.45,-0.75; 20 2.45,-0.25; 21 2.45,0.25; 22 2.45,0.75; 23 2.45,1.25; 24 2.45,1.75 | smd 0.3 x 0.8: 9 -1.75,-2.45; 10 -1.25,-2.45; 11 -0.75,-2.45; 12 -0.25,-2.45; 13 0.25,-2.45; 14 0.75,-2.45; 15 1.25,-2.45; 16 1.75,-2.45; 25 1.75,2.45; 26 1.25,2.45; 27 0.75,2.45; 28 0.25,2.45; 29 -0.25,2.45; 30 -0.75,2.45; 31 -1.25,2.45; 32 -1.75,2.45 | smd 3.3 x 3.3: EXP 0,0
DCC6C-3X3 = smd 0.6 x 1.6: 1 -1.27,-1.2 | smd 0.6 x 1.1: 2 0,-1.45; 3 1.27,-1.45; 4 1.27,1.45; 5 0,1.45; 6 -1.27,1.45
VQFN24-4X4 = smd 0.7 x 0.3: 1 -1.9,1.25; 2 -1.9,0.75; 3 -1.9,0.25; 4 -1.9,-0.25; 5 -1.9,-0.75; 6 -1.9,-1.25; 13 1.9,-1.25; 14 1.9,-0.75; 15 1.9,-0.25; 16 1.9,0.25; 17 1.9,0.75; 18 1.9,1.25 | smd 0.3 x 0.7: 7 -1.25,-1.9; 8 -0.75,-1.9; 9 -0.25,-1.9; 10 0.25,-1.9; 11 0.75,-1.9; 12 1.25,-1.9; 19 1.25,1.9; 20 0.75,1.9; 21 0.25,1.9; 22 -0.25,1.9; 23 -0.75,1.9; 24 -1.25,1.9 | smd 2.5 x 2.5: GND 0,0
2.5X2.0MM = smd 1 x 1: 1 -0.825,-0.625; 2 0.825,-0.625; 3 0.825,0.625; 4 -0.825,0.625
J502-ND-142-0711-871/876 = smd 3.8 x 0.9: 1 -2.4,0; G@1 -2.4,-2.77; G@2 -2.4,2.77 | smd 3.8 x 0.9 bottom: G@3 -2.4,2.77; G@4 -2.4,-2.77
2.0X1.6MM = smd 0.6 x 0.8: 1 -0.9,-0.6; 2 0.9,-0.6; 3 0.9,0.6; 4 -0.9,0.6

### Placement (x,y rotation side)
C1  16.25,24.9 0 top
C2  21,39.9 90 top
C3  6.25,32.75 180 top
C4  6.25,30.8 180 top
C5  41.8,37.3 90 bottom
C6  41.8,35.3 270 bottom
C7  6.25,29.75 180 top
C8  11.6,38.9 90 top
C9  12.75,25.9 270 top
C10  15.8,26.35 0 top
C11  16.05,38.9 0 top
C12  16.05,37.9 0 top
C13  40,23 270 top
C14  1.8,43.9 90 bottom
C15  19.4,32.1 270 top
C16  6.2,40.65 90 bottom
C17  37.5,40.5 270 bottom
C18  12.5,50.65 0 bottom
C19  22.1,31.8 0 bottom
C20  15.95,47.6 270 bottom
C21  41.4,44.05 0 bottom
C22  44.25,39.75 270 bottom
C23  8.55,46 90 bottom
C24  100nF  [C0402']  27.25,31.8 90 bottom
C25  22.25,33.8 0 bottom
C26  12,42.95 180 bottom
C27  22.25,29.8 0 bottom
C28  30.1,47.05 90 top
C29  24.85,24.6 180 top
C30  25.55,35.45 270 top
C31  27.2,31.15 90 top
C32  27.2,42.85 90 top
C33  28.2,31.15 270 top
C34  28.2,42.85 270 top
C35  29.2,31.15 270 top
C36  29.2,42.85 270 top
C37  31.2,31.15 270 top
C38  31.2,42.85 270 top
C39  30.9,23 180 top
C40  31.9,34.8 0 top
C41  32.2,31.15 90 top
C42  30.2,42.85 90 top
C43  34.05,38.18 0 top
C44  30.2,31.15 90 top
C45  32.2,42.85 90 top
C46  34.05,39.2 0 top
C47  37.7,31.8 0 top
C48  38.2,33.25 90 top
C49  44.95,41.85 0 top
C50  44.75,33.45 90 top
C51  43.5,38.3 135 top
C52  47.45,42.8 180 top
C53  45.4,39.7 180 top
C54  46.95,41.35 90 top
C55  50.95,41.35 270 top
C56  49.95,41.35 270 top
C57  51.45,35.5 270 top
C58  52.95,40.35 90 top
C59  52.95,35 0 top
C60  54.4,35.5 270 top
C61  51.95,40.35 90 top
C62  57.3,35.5 270 top
C63  52.95,38.4 90 top
C64  59.65,36 0 top
D1  40,15.57 270 top
D2  17.95,49.5 90 top
D3  15.65,49.5 90 top
D4  13.3,49.5 90 top
D5  10.95,49.5 90 top
D6  8.65,49.5 90 top
D7  26.1,31.15 90 top
D8  26.1,42.8 90 top
D9  58.25,35.6 270 top
FB1  20,39.9 270 top
FB2  5.05,40.55 270 bottom
FB3  37.5,43.6 270 bottom
FB4  31.1,47.05 270 top
FB5  45,43.15 180 top
J1  65,56.5 180 top
L1  19.45,49.12 90 bottom
L2  5.05,44.48 90 bottom
L3  33.9,31.8 180 top
L4  35.8,31.8 180 top
L5  45.4,40.7 180 top
L6  47.95,41.35 90 top
L7  48.95,41.35 270 top
L8  50.5,39.85 180 top
L9  52.95,36 180 top
L10  55.85,36 180 top
L11  51.95,38.4 90 top
R1  8.57,37.95 270 top
R2  40.35,36.8 0 bottom
R3  40.35,35.8 0 bottom
R4  6.25,34.55 270 top
R5  16.05,39.9 180 top
R6  21.1,37.5 45 top
R7  17.95,46.25 90 top
R8  40,18.75 90 top
R9  15.65,46.25 90 top
R10  22.4,30.8 315 top
R11  13.3,46.25 90 top
R12  22.35,36.25 315 top
R13  22.35,28.35 225 top
R14  10.95,46.25 90 top
R15  8.65,46.25 90 top
R16  28.4,32.3 270 bottom
R17  26.85,33.85 0 bottom
R18  43.25,41.62 90 bottom
R19  43.25,39.75 90 bottom
R20  45.25,39.75 270 bottom
R21  40.1,37.75 270 top
R22  40.6,39.2 180 top
R23  41.1,37.75 270 top
R24  42.95,35.55 0 top
R25  52.35,32.6 90 top
U1  13.05,32.05 0 top
U2  50.6,18.5 0 top
U3  40.45,41.45 90 bottom
U4  12.25,46.8 0 bottom
U5  25.25,31.8 180 bottom
U6  28.95,26.65 270 top
U7  28.95,38.45 270 top
U8  37.35,39.2 270 top
U9  41,31.8 90 top
U10  48.1,36.75 0 top
U11  48.35,31.35 90 top
X1  18.3,39.08 90 top
X2  64.95,11.75 0 top
X3  28.1,47.05 180 top
X4  64.95,36 0 top

### Tracks (layer width: path | path; a pad name or v marks a point on that pad's centre or on a via)
+5V  (via drill 0.3)
  PWR 0.5: v28.4,33.85 29.55,33.85 30.15,33.25 30.15,32.4 29.55,31.8 24.09,31.8 v23.7,32.2 22.9,32.2 22.55,31.85 22.55,20.5 | J1.4 J1.2 57.83,2.73 58.65,3.55 58.65,17 55.15,20.5 22.55,20.5 | v9.9,44.37 9.9,47.9 v10,48 v10,48.7 10.55,49.25 v14.55,49.25 | v9.9,44.37 9.9,43.6 12.6,43.6 v12.6,44.45 13.75,45.6 v14.55,45.6 | v9.9,44.37 4.47,44.37 3,42.9 3,24 6.5,20.5 22.55,20.5
  Bottom 0.2: U4.14 10.6,47.2 10.45,47.35 10.45,47.6 | U4.15 10.45,47.6 | 10.45,47.6 10.45,48 | U4.16 10.45,48 | U4.17 12.05,48.7 v10,48.7 | U4.5 13.95,46.4 14.55,45.8 v14.55,45.6 | U4.1 13.85,48 14.35,48.5 v14.35,48.6 14.35,49.05 v14.55,49.25 15.7,49.25 C20.1 | 10.45,48 v10,48 | v12.6,44.45 12.45,44.6 U4.8 | U4.10 11.13,45.6 v9.9,44.37 | C23.1 9.9,44.6 v9.9,44.37 | v9.9,44.37 v9.9,45.07 | 23.7,31.8 v23.7,32.2 22.9,32.2 C19.1 22.9,31.4 v23.7,31.4 23.7,31.8 | 23.7,31.8 U5.2
  Bottom 0.4: R16.1 v28.4,33.85 R17.1
  pour Bottom (isolate 0.2, rank 2, no thermals): 11.58,47.2 11.58,48 12.05,48 12.05,49.15 9.75,49.15 9.75,47.95 10.5,47.2
  pour Bottom (isolate 0.2, rank 2, no thermals): 13,48 13,48.25 14.45,49.7 16.75,49.7 16.75,48.3 14.15,48.3 13.85,48
  pour Bottom (isolate 0.2, rank 2, no thermals): 7.75,43.9 7.75,45.35 10.55,45.35 10.8,45.6 11.55,45.6 11.55,45.45 10,43.9
  pour Bottom (isolate 0.152, rank 2, no thermals): 24.8,31.9 23.9,31.9 23.9,32.65 22.1,32.65 22.1,30.95 23.9,30.95 23.9,31.7 24.8,31.7
  pour PWR (isolate 0.2, no thermals): 3.95,39.95 6,42 14.6,42 15.6,43 15.6,46.15 15.3,46.45 13.85,46.45 12.7,45.3 11.55,45.3 10.95,45.9 10.95,47.6 11.7,48.35 13.1,48.35 13.85,49.1 15.35,49.1 15.35,50.65 9.3,50.65 7.6,48.95 7.6,46.2 6.5,45.1 2.15,45.1 0.95,43.9
  pour PWR (isolate 0.2, rank 4): 0,53.5 0,3 arc90 3,0 62,0 arc90 65,3 65,53.5 arc90 62,56.5 3,56.5 arc90
CLKHS
  Top 0.3: U1.53 14.8,39.65 15.05,39.9 R5.2
CLKI
  Top 0.3: R6.2 22.8,39.2 U7.11
CLKO_B
  Top 0.3: U6.10 25.3,27.9 R10.2
FEM_EN  (via drill 0.3)
  Top 0.3: U10.1 v46.2,38.7
  Bottom 0.3: v46.2,38.7 45.7,38.7 45.25,39.15 R20.2
GND  (via drill 0.3)  (1 unrouted)
  Top 0.2: C11.2 C12.2 16.55,37.4 16.8,37.15 U1.49 16.8,35.8 | R13.1 | R13.7 | R13.7 R13.8 | R13.8 | U1.48 16.8,35.8 | 16.8,35.8 v16.3,35.3 U1.50 | U1.51 15.8,35.45 v15.65,35.3 | U1.41 16.3,32.3 v16.3,32.7 | U1.40 16.3,31.8 v16.3,32.05 | U1.34 v16.3,28.8 | U1.31 v16.3,28.8 | U1.30 15.8,28.8 v15.65,28.8 | U1.32 16.8,28.3 | 16.8,28.3 v16.3,28.8 | U1.33 16.8,28.3 | U1.16 9.3,28.3 v9.8,28.8 | U1.24 12.8,28.8 v13.05,28.8 | U1.11 9.8,30.8 v9.8,30.75 | U1.6 9.8,33.3 v9.8,33.35 | U1.59 11.8,35.3 v11.75,35.3 | U7.4 29.2,40 | U7.7 27.7,39.8 | U7.31 30.3,39.7 | U7.28 30.5,38.2 | U7.26 30.3,37.2 | U6.26 30.3,25.4 | 27.4,26.4 U6.13 24.65,26.4 R13.7 | 27.4,26.9 U6.12 25.04,26.9 R13.8 | U6.7 27.7,28 | U6.4 29.2,28.2 | U6.31 30.3,27.9 | U6.28 30.5,26.4 v30.25,26.65 | U1.7 9.8,32.8 v9.8,32.7 | U1.10 9.8,31.3 v9.8,31.4 | C15.2 20.34,31.6 R13.1 | R13.1 22.67,29.27 22.23,28.83 R13.2 20.6,30.45 v19.39,30.45 | C3.2 v5.05,32.75 | C39.2 v29.55,23 | U10.19 49.35,38 | 49.35,38 48.85,37.5 | 48.85,37.5 U10.GND | U10.18 49.35,38 | U10.17 48.85,37.5 | U10.15 48.35,36.5 | U10.13 49.35,35.5 U10.GND | U10.10 48.35,36.5 | 48.35,36.5 U10.GND | U10.8 47.35,36 | 47.35,36 U10.GND | U10.7 46.85,35.5 47.35,36 | C8.2 v11.6,41.35
  Top 0.3: U10.10 v48.35,32.62 | U11.3 v48.35,32.62 | C43.2 35,38.18 35.25,37.93 U8.3 v36.95,37.93 | C41.2 C37.1 C44.2 C35.1 C33.1 | U10.13 v50,35 C57.2 | 29.2,40 v28.95,39.75 | 27.7,39.8 v27.65,39.75 | 30.3,39.7 v30.25,39.75 | 30.5,38.2 v30.25,38.45 | 30.3,37.2 v30.25,37.15 | 30.3,25.4 v30.25,25.35 | 27.4,26.4 v27.65,26.65 27.4,26.9 | 27.7,28 v27.65,27.95 | 29.2,28.2 v28.95,27.95 | 30.3,27.9 v30.25,27.95 | C52.2 v46.95,43.7 | C61.2 v51.95,41.8 | 52,40.85 C55.2 C56.2 | C53.2 v44.9,38.3 | D9.2 v58.25,34.2 | C62.2 v56.35,35 | v55.3,35 C60.2 | C41.2 32.8,31.65 32.95,31.8 L3.2 | U1.31 C10.2 16.35,26.3 v17.2,26.3 C1.2 | C9.2 v13.6,25.4 | v18.93,41.25 X1.2 | C2.2 v23.45,40.4 | U9.4 v39.55,33.75 C48.2 | U9.3 v42.45,33.75 R24.1 | U9.6 v39.55,29.75 | U9.1 v42.2,29.75 | C63.2 v53.9,38.9 | C58.2 v53.9,40.85 | C28.2 29.6,47.55 29.5,47.65 X3.1 X3.2 v26.1,47.65 | U8.4 v37.75,37.93 | v43.05,37.45 42.85,37.25 R23.2 R21.2 | U8.1 v35.05,40.47 | U8.6 v40.45,40.47 v40.45,40.48 | R25.1 v52.35,31.2 | U11.4 v48.35,32.62 | U11.1 v49.55,29.3 | v46.9,29.3 U11.6 | v5.05,30.8 C4.2 C7.2 v5.05,29.75 | X4.G@4 v62.55,31.95 | X4.G@3 v62.55,40.05 | v25.28,34.1 25.55,34.37 C30.2 | C36.1 v29.2,44.45 | C41.2 v32.2,32.85 | C29.2 v23.4,24.6 | v32.4,33.95 C40.2 | U2.19 v56.4,23.75 | U2.12 v56.35,13.25 | X2.G@2 v62.55,15.95 | X2.G@4 v62.55,7.55 | R1.1 v8.57,40.45 | D5.C 10.95,52.9 v11.1,53.05
  Top 0.4: C49.2 C54.2 C52.2 | C61.2 52,40.85 C58.2 | C45.2 C38.1 C42.2 C36.1 C34.1 | D6.C D5.C D4.C D3.C D2.C | U2.8 D1.C 39.05,14.75 38.6,15.2 v38.6,15.95 | U2.3 40.95,22.25 40.7,22.5 C13.2 v39.05,22.5
  Bottom 0.2: C20.2 14.85,46.2 14.25,46.8 | 14.25,46.8 13.85,47.2 U4.3 v12.25,47.2 | 14.25,46.8 U4.4 12.25,46.8 | v12.25,47.2 12.25,46.8 | 12.25,46.8 U4.13 10.35,46.8 | 12.25,46.8 v12.25,46.4 U4.T2 12.15,46.4 U4.12 10.75,46.4 10.35,46.8 | U4.T1 v12.25,47.2 | C23.2 9.75,47.4 10.35,46.8 | U4.6 13.8,46 13.97,45.83 13.97,45.6 | U4.7 13.97,45.6 | 13.97,45.6 13.97,45.08 v14.45,44.6 | C24.2 26.7,32.45 26.45,32.2 U5.5 26,32.23 v26,32.84 | C27.2 19.65,29.8 19.39,30.05 v19.39,30.45
  Bottom 0.3: R19.1 C22.2 44.25,38.95 v44.9,38.3 | U3.8 v40.45,40.48 | v40.45,40.48 U3.GND | C27.2 C19.2 C25.2 | C26.2 15,42.95 15.95,43.9 C20.2 | C6.2 41.8,33.95 42,33.75 v42.45,33.75 | C17.2 40.2,39.55 40.45,39.8 v40.45,40.48 | C5.2 42.7,37.8 v43.05,37.45 | X4.G@4 v62.55,31.95 | X4.G@3 v62.55,40.05 | X2.G@4 v62.55,7.55 | X2.G@2 v62.55,15.95 | 6.3,41.73 6.2,41.62 | v11.1,53.05 C18.2
  Bottom 0.4: C18.2 9.25,50.65 8.55,49.95 C23.2 | C14.2 v1.8,46.35 | R19.1 42.8,39.25 v42.2,39.85 41.92,40.12 U3.8
  Bottom 0.6: U3.GND C21.2
  other vias: 28.3,39.75 29.6,39.75 27.65,39.1 27.65,38.45 27.65,37.8 27.65,37.15 28.3,39.1 28.95,39.1 29.6,39.1 30.25,39.1 28.3,38.45 28.95,38.45 29.6,38.45 28.3,37.8 28.95,37.8 29.6,37.8 30.25,37.8 28.3,37.15 28.95,37.15 29.6,37.15 27.65,27.3 27.65,26 27.65,25.35 28.3,27.95 29.6,27.95 28.3,27.3 28.95,27.3 29.6,27.3 30.25,27.3 28.3,26.65 28.95,26.65 29.6,26.65 28.3,26 28.95,26 29.6,26 30.25,26 28.3,25.35 28.95,25.35 29.6,25.35 9.8,35.3 10.45,35.3 11.1,35.3 12.4,35.3 13.05,35.3 13.7,35.3 14.35,35.3 15,35.3 10.45,32.7 11.1,32.7 11.75,32.7 12.4,32.7 13.05,32.7 13.7,32.7 14.35,32.7 15,32.7 15.65,32.7 10.45,33.35 11.1,33.35 11.75,33.35 12.4,33.35 13.05,33.35 13.7,33.35 14.35,33.35 15,33.35 15.65,33.35 16.3,33.35 9.8,32.05 10.45,32.05 11.1,32.05 11.75,32.05 12.4,32.05 13.05,32.05 13.7,32.05 14.35,32.05 15,32.05 15.65,32.05 9.8,34.65 10.45,34.65 11.1,34.65 11.75,34.65 12.4,34.65 13.05,34.65 13.7,34.65 14.35,34.65 15,34.65 15.65,34.65 16.3,34.65 9.8,34 10.45,34 11.1,34 11.75,34 12.4,34 13.05,34 13.7,34 14.35,34 15,34 15.65,34 16.3,34 9.8,29.45 10.45,29.45 11.1,29.45 11.75,29.45 12.4,29.45 13.05,29.45 13.7,29.45 14.35,29.45 15,29.45 15.65,29.45 16.3,29.45 9.8,30.1 10.45,30.1 11.1,30.1 11.75,30.1 12.4,30.1 13.05,30.1 13.7,30.1 14.35,30.1 15,30.1 15.65,30.1 16.3,30.1 10.45,28.8 11.1,28.8 11.75,28.8 12.4,28.8 13.7,28.8 14.35,28.8 15,28.8 10.45,31.4 11.1,31.4 11.75,31.4 12.4,31.4 13.05,31.4 13.7,31.4 14.35,31.4 15,31.4 15.65,31.4 16.3,31.4 10.45,30.75 11.1,30.75 11.75,30.75 12.4,30.75 13.05,30.75 13.7,30.75 14.35,30.75 15,30.75 15.65,30.75 16.3,30.75 32.65,36.85 34.4,37.25 33.7,35.05 33.5,36.15 33.7,33.95 33.7,32.85 33.7,30.7 33.7,29.7 33.7,28.7 33.6,27.65 33.05,26.85 32.7,25.3 33.95,25.65 34.7,26.6 35.1,27.8 35.1,30.7 35.1,29.7 35.1,28.7 35.1,36.15 35.15,32.85 35.15,33.95 35.15,35.05 36.15,32.85 37.15,32.85 37.1,30.7 36.1,30.7 38.1,30.7 44,31 45.15,31.55 43.7,32.5 45.5,34.75 44,34.75 46.55,34.05 51.4,33.25 51.45,31.9 52.45,36.95 53.45,36.95 54.45,36.95 55.45,36.95 56.45,36.95 57.45,36.95 58.45,36.95 59.45,36.95 60.45,36.95 61.45,36.95 62.45,36.95 63.45,36.95 63.45,34.95 62.45,34.95 61.45,34.95 60.45,34.95 59.45,34.95 42,38.5 60.25,12.9 61.5,12.9 62.85,12.9 64.1,12.9 62.85,10.55 61.45,10.55 60.25,10.55 64.1,10.55
  pour GND (isolate 0.406, no thermals): 0,53.5 0,3 arc90 3,0 62,0 arc90 65,3 65,53.5 arc90 62,56.5 3,56.5 arc90
  pour Top (isolate 0.2): 0,53.5 0,3 arc90 3,0 62,0 arc90 65,3 65,53.5 arc90 62,56.5 3,56.5 arc90
  pour Bottom (isolate 0.406, rank 4): 3,0 arc-90 0,3 0,53.5 arc-90 3,56.5 62,56.5 arc-90 65,53.5 65,3 arc-90 62,0
  pour Bottom (isolate 0.2, rank 4, no thermals): 12,46.4 10.45,46.4 10.15,46.7 7.75,46.7 7.75,47.4 9.75,47.4 10.35,46.8 12,46.8
  pour Bottom (isolate 0.2, rank 4, no thermals): 12,47.6 12.5,47.6 12.5,46 12,46
  pour Bottom (isolate 0.2, rank 4, no thermals): 12.5,47.2 16.75,47.2 16.75,40.05 12.7,40.05 12.7,44.05 15.15,44.05 15.15,45.75 14.1,46.8 12.5,46.8
  pour Bottom (isolate 0.2, rank 2, no thermals): 35.75,40.6 45.1,40.6 45.1,38.65 35.75,38.65
  pour Bottom (isolate 0.2, no thermals): 25.7,33.25 25.7,32.2 27.6,32.2 27.6,33.25
GPSRX
  Top 0.3: J1.8 47.8,3.94 47.8,10.4 46.45,11.75 U2.10
GPSTX  (via drill 0.3)
  Top 0.3: v48.95,7.7 48.95,10.1 45.8,13.25 U2.9
  Bottom 0.3: J1.10 47.8,4.06 47.8,6.55 v48.95,7.7
IRXD_A
  Top 0.2: R12.5 24.54,37.2 U7.15
IRXD_B
  Top 0.2: U6.15 24.06,25.4 R13.5
ITXD_A
  Top 0.2: R12.7 23.95,38.2 U7.13
LNA_EN  (via drill 0.3)
  Top 0.2: U10.3 43.75,37 v43.28,36.53
  Bottom 0.3: v43.28,36.53 43.01,36.8 C5.1 R2.1
MISO_A  (via drill 0.3)
  Top 0.2: v27.52,34.8 27.7,34.98 U7.18 | v10.4,39.94 10.1,39.64 10.1,37.42 10.3,37.23 U1.62
  Bottom 0.2: v27.52,34.8 26.93,35.4 26.62,35.4 22.93,39.09 12,39.09 11.15,39.94 v10.4,39.94
MISO_B
  Top 0.2: U6.18 27.7,23.6 27.25,23.15 22,23.15 12.05,23.15 11.3,23.9 U1.21
MOSI_A  (via drill 0.3)
  Top 0.2: v28.38,34.8 28.2,34.98 U7.19 | v10.35,40.8 9.7,40.15 9.7,37.17 9.8,37.08 U1.63
  Bottom 0.2: v28.38,34.8 27.38,35.8 26.8,35.8 23.15,39.45 12.15,39.45 10.8,40.8 v10.35,40.8
MOSI_B
  Top 0.2: U1.20 10.8,23.9 11.91,22.8 27.39,22.8 28.2,23.6 U6.19
N$1
  Bottom 0.2: L1.1 U4.2
  pour Bottom (isolate 0.2, no thermals): 12.85,47.7 16.55,47.7 17.5,48.65 21.2,48.65 21.2,46.55 17.65,46.55 16.7,47.5 12.85,47.5
N$2
  Bottom 0.2: U4.11 L2.2
  pour Bottom (isolate 0.2, no thermals): 11.6,46.1 10.15,46.1 9.85,46.4 7.5,46.4 6.75,47.15 2.95,47.15 2.95,45.35 7.05,45.35 7.05,45.35 7.5,45.9 11.6,45.9
N$3
  Bottom 0.3: U3.7 R18.1 R19.2
N$4
  Bottom 0.2: C24.1 26.7,31.15 26.45,31.4 U5.7
N$5  (via drill 0.3)
  Top 0.3: R6.1 20.75,37.1 20.2,36.55 v19.3,36.55 | v18.5,31.3 U1.39
  Bottom 0.3: v19.3,36.55 19.3,32.1 v18.5,31.3
N$6
  cutout Top: 9.5,35.6 16.6,35.6 16.6,28.5 9.5,28.5
N$7
  Top 0.3: U1.58 12.3,42.51 11.61,43.2 9.1,43.2 8.65,43.65 R15.1
N$8
  Top 0.3: U1.56 R11.1
N$9
  cutout Bottom: 12.95,46 14,46 14,45.35 12.95,45.35
N$10
  Top 0.2: R4.8 7.4,35.42 7.53,35.3 U1.2
N$11
  Top 0.2: R4.7 U1.3
N$12
  Bottom 0.3: U3.3 37.83,41.77 C17.1 37.83,41.12 U3.2
  Bottom 0.6: FB3.2 C17.1
  pour Bottom (isolate 0.2, no thermals): 37,41.9 39.25,41.9 39.25,41 37,41
N$13
  Top 0.3: C40.1 U7.25
N$14
  Top 0.2: R4.6 U1.4
N$15
  Top 0.2: U1.36 20.55,29.8 R13.3
N$17
  Top 0.3: X1.3 R5.1
N$18
  Top 0.3: X3.4 29.5,46.45 29.6,46.55 C28.1 FB4.2
N$19
  Top 0.3: U10.12 49.35,34.35 arc90 49.75,33.95 51.9,33.95 arc-90 52.35,33.5 R25.2
N$20
  Top 0.3: U10.9 47.85,34.15 arc-90 47.1,33.4 46.3,33.4 arc90 45.85,32.95 45.85,31.75 arc90 46.25,31.35 U11.5
N$21
  Top 0.3: U11.2 50.4,31.35 arc90 50.8,31.75 50.8,32.85 arc90 50.25,33.4 49.55,33.4 arc-90 48.85,34.1 U10.11
N$22
  Top 0.3: R24.2 44.22,35.55 44.67,36 U10.5
N$23
  Top 0.3: U10.23 47.35,39.39 47.95,39.99 L6.1 C54.1
N$24
  Top 0.3: L8.1 51.9,39.85 | 51.9,39.85 C61.1 C58.1 | L11.2 arc-90 51.9,38.95 51.9,39.85
N$25
  Top 0.3: U10.24 46.85,39.4 46.55,39.7 C53.1 L5.1
N$26
  Top 0.3: U10.21 48.35,39.55 48.95,40.15 L7.2
N$27
  Top 0.3: C59.2 L9.1 C60.1 L10.2
N$28  (via drill 0.3)
  Top 0.2: U1.14 7.7,29.3 6.85,28.45 v6.85,26.6
  Bottom 0.2: R2.2 38.6,36.8 37.95,36.15 37.95,32.75 37.05,31.85 30.35,31.85 27.7,29.2 26.2,29.2 21.4,24.4 9.9,24.4 7.7,26.6 v6.85,26.6
N$29  (via drill 0.3)
  Top 0.2: U1.15 8,28.8 7.5,28.3 v7.5,25.89
  Bottom 0.2: R3.2 38.95,35.8 38.35,35.2 38.35,32.55 37.3,31.5 30.5,31.5 27.85,28.85 26.35,28.85 21.55,24.05 9.74,24.05 7.9,25.89 v7.5,25.89
N$30
  Top 0.3: U10.20 48.85,39 arc-90 49.7,39.85 L8.2
N$31
  Top 0.3: C63.1 L11.1 51.95,37.6 arc-90 51.35,37 U10.16
N$32
  Top 0.3: U10.14 C57.1 L9.2 C59.1
N$33
  Top 0.2: R4.5 7.4,33.67 7.53,33.8 U1.5
N$34
  Top 0.3: L10.1 C62.1 D9.1 C64.1
N$35
  Top 0.3: C51.1 43.97,37.83 arc42 44.71,37.5 U10.2
N$36
  Top 0.3: U10.6 45.65,35.5 arc90 44.75,34.6 C50.2
N$37
  Top 0.3: C51.2 arc59 42.19,39.2 R22.1 R23.1
N$38
  Top 0.2: C9.1 12.75,26.65 12.3,27.1 U1.23
N$39
  Top 0.3: R21.1 R22.2 U8.5
N$40
  Top 0.3: U8.2 C46.2
N$41
  Top 0.3: U9.2 43.9,31.8 arc90 44.75,32.65 C50.1
N$42
  Top 0.4: R7.2 D2.A
N$43
  Top 0.3: U9.5 C47.2 C48.1
N$44
  Top 0.3: L4.1 C47.1
N$45
  Top 0.4: R9.2 D3.A
N$46
  Top 0.3: C46.1 U7.30
N$47
  Top 0.3: C39.1 U6.25
N$48
  Top 0.2: D7.C 26.1,29.5 26.5,29.1 U6.9
N$49
  Top 0.3: U6.8 C31.1
N$50
  Top 0.2: U1.35 20.16,29.3 R13.4
N$51
  Top 0.3: U2.11 X2.1
N$52
  Top 0.2: U7.8 C32.1
N$53
  Top 0.3: U7.1 30.7,41.35 31.2,41.85 C38.2
N$54
  Top 0.3: U6.1 30.7,29.55 31.2,30.05 C37.2
N$55
  Top 0.3: U6.3 29.7,29.65 29.2,30.15 C35.2
N$56
  Top 0.3: U6.5 28.7,29.7 28.2,30.2 C33.2
N$57
  Top 0.3: U7.3 29.7,41.4 29.2,41.9 C36.2
N$58
  Top 0.3: R10.1 19.9,33.3 U1.43
N$59
  Top 0.2: U1.44 21.14,33.8 R12.4
N$60
  Top 0.2: U1.45 20.75,34.3 R12.3
N$61
  Top 0.2: U1.46 20.55,34.8 R12.2
N$62
  Top 0.2: U1.47 20.16,35.3 R12.1
N$63
  Top 0.3: U7.5 28.7,41.4 28.2,41.9 C34.2
N$64
  Top 0.3: U7.29 32.3,38.7 32.82,38.18 C43.1
N$65
  Top 0.3: C64.2 X4.1
N$66
  Top 0.4: R11.2 D4.A
N$67
  Top 0.2: U1.52 15.3,37.15 15.55,37.4 C12.1 C11.1
N$68
  Top 0.4: R14.2 D5.A
N$69
  Top 0.4: R15.2 D6.A
N$70
  Top 0.3: U7.9 26.5,40.9 26.1,41.3 D8.C
N$71
  Top 0.3: U1.55 13.8,42.85 15.65,44.7 R9.1
N$72
  Top 0.4: U2.5 R8.2
N$76
  Top 0.4: R8.1 D1.A
NSS_A  (via drill 0.3)
  Top 0.2: U7.20 28.7,35.3 v29.2,34.8 | v9.65,41.35 9.3,41 U1.64
  Bottom 0.2: v29.2,34.8 27.8,36.2 26.9,36.2 23.3,39.8 12.35,39.8 10.8,41.35 v9.65,41.35
NSS_B
  Top 0.2: U6.20 28.7,23.61 27.54,22.44 11.76,22.44 10.3,23.91 U1.19
PA_EN  (via drill 0.3)
  Top 0.2: U10.4 44.18,36.5 v44.1,36.42
  Bottom 0.3: v44.1,36.42 43.48,35.8 C6.1 R3.1
PPS  (via drill 0.3)
  Top 0.3: U1.9 v4.55,31.8 | U2.13 v55.75,14.75
  Bottom 0.3: v4.55,31.8 3,30.25 3,14 6,11 6,2 7,1 34.58,1 J1.18 37.6,4.02 37.6,7.6 39,9 50,9 v55.75,14.75
Q1_VCC
  Top 0.3: 20,38.25 X1.1 X1.4 | 20,38.25 20.6,38.25 21,38.65 C2.1 | FB1.2 20,38.25
QRXD_A
  Top 0.2: R12.6 24.15,37.7 U7.14
QRXD_B
  Top 0.2: R13.6 24.45,25.9 U6.14
QTXD_A
  Top 0.2: R12.8 23.56,38.7 U7.12
RADIO_EN_A
  Bottom 0.2: U5.6 R16.2
RADIO_EN_B
  Bottom 0.2: R17.2 25.9,33.85 25.25,33.2 U5.4
RADIO_RST  (via drill 0.3)
  Top 0.2: v13.6,26.7 13.3,27 U1.25 | v25.25,29.1 25.25,29.14 24.64,29.75 24.64,31.85 | 24.64,31.85 D7.A | 24.64,31.85 24.64,32.26 23.6,33.3 v23.6,35.1
  Top 0.3: v26.1,44.5 D8.A
  PWR 0.3: v23.6,35.1 23.6,36.15 25.3,37.85 25.3,43.7 v26.1,44.5
  Bottom 0.2: v13.6,26.7 13.6,26.36 15.21,24.75 21.26,24.75 25.25,28.75 v25.25,29.1
RESET  (via drill 0.3)
  Top 0.2: R1.2 U1.1 7.74,35.8 7.5,36.04 3.15,36.04 1.59,34.48 1.59,9.77 3.72,7.64 27.21,7.64 v27.6,7.25
  Bottom 0.2: v27.6,7.25 28.9,7.25 29.95,6.2 29.95,4.01 J1.22
RF_IN
  Top 0.3: U7.27 32.1,37.7 arc-90 34.4,35.4 L3.1 | U6.27 32.1,25.9 arc90 34.4,28.2 L3.1 | L4.2 L3.1
RX_ON
  Top 0.3: U1.57 12.8,42.85 10.95,44.7 R14.1
SCK_A  (via drill 0.3)
  Top 0.2: U7.17 27.2,35.31 v26.69,34.8 | v10.76,39.2 10.5,38.95 10.5,37.58 10.8,37.27 U1.61
  Bottom 0.2: v26.69,34.8 22.75,38.74 11.81,38.74 11.36,39.2 v10.76,39.2
SCK_B
  Top 0.2: U6.17 27.2,23.65 27.05,23.5 12.2,23.5 11.8,23.9 U1.22
SPI_MISO
  Top 0.2: R4.2 3.25,34.8 2.29,33.84 2.29,10.26 4.11,8.45 30.05,8.45 31.23,7.27 J1.21
SPI_MOSI
  Top 0.2: R4.3 3.4,34.3 2.65,33.55 2.65,10.5 4.3,8.85 33.09,8.85 33.77,8.17 J1.19
SPI_NSS  (via drill 0.3)
  Top 0.2: R4.4 3.48,33.67 3,33.2 3,10.75 4.5,9.25 25.4,9.25 v25.8,9.65
  Bottom 0.2: v25.8,9.65 25.8,7.85 27.45,6.2 27.45,3.97 J1.24
SPI_SCK
  Top 0.2: R4.1 3.23,35.42 1.94,34.14 1.94,10.01 3.91,8.04 27.92,8.04 28.69,7.27 J1.23
TX_ON
  Top 0.3: U1.54 14.3,36.57 14.3,42.51 17.19,45.4 R7.1
V+
  Top 0.4: C13.1 40.7,23.5 40.95,23.75 42,23.75 U2.2
  Top 0.6: J1.1 56.63,8.77 53.63,11.77 53.63,23.75 | 53.63,23.75 42,23.75 | U2.1 52.75,25.25 53.63,24.37 53.63,23.75
VCC
  Bottom 0.2: C26.1 10.6,43.2 12.05,44.65 U4.9
  Bottom 0.4: FB2.1 L2.1
  Bottom 0.6: C26.1 L2.1 C14.1
  pour Bottom (isolate 0.2, no thermals): 11.95,45.65 11.95,45.5 10.2,43.75 1.15,43.75 1.15,40.85 5.4,40.85 5.4,42.25 11.3,42.25 11.3,43.9 12.05,44.65 12.05,45.65
VCC_FEM  (via drill 0.3)
  Top 0.3: L5.2 44.4,40.7 44.15,40.95 C49.1 FB5.2 v44.15,44.75 | v49.95,42.65 v48.95,42.65 L7.1 C56.1 v49.95,42.65 | C55.1 v50.95,42.65 v49.95,42.65
  Top 0.4: C56.1 C55.1
  PWR 0.3: v48.95,42.65 48.95,44.05 48.25,44.75 v44.15,44.75
VCCA_A  (via drill 0.3)
  Top 0.3: U7.32 31.4,40.95 v32.2,41.75 C45.1 | U7.2 v30.2,41.75 C42.1 | C52.1 v47.95,43.5 | v24.52,35.95 C30.1 26.2,35.95 26.5,36.25 U7.16 | FB4.1 v32.2,47.55
  Top 0.4: C52.1 L6.2
  PWR 0.3: v47.95,43.5 46.2,41.75 v32.2,41.75 | v32.2,41.75 v30.2,41.75 26.65,41.75 25.86,40.96 25.86,37.65 24.52,36.32 v24.52,35.95 | v32.2,47.55 v32.2,41.75
  Bottom 0.2: v24.52,35.95 24.52,33.8 | 24.52,33.8 U5.3 | C25.1 24.52,33.8
  other vias: 24.52,35.25 24.52,34.45
  pour Bottom (isolate 0.152, no thermals): 24,36.55 24.95,36.55 24.95,32.2 24.25,32.2 24.25,33.1 22.3,33.1 22.3,34.6 24,34.6
VCCA_B  (via drill 0.3)
  Top 0.3: U6.32 31.4,29.1 32.2,29.9 v32.2,30 C41.1 | C29.1 25.8,24.6 26.1,24.9 U6.16 v26.5,24.15 | U6.2 v30.2,30 C44.1
  PWR 0.3: v32.2,30 v30.2,30 26.5,30 | 26.5,30 v25.25,30 | v26.5,24.15 26.5,30
  Bottom 0.2: C27.1 24.52,29.8 24.52,30 | v25.25,30 24.52,30 | 24.52,30 U5.1
  other vias: 24.05,30.15
  pour Bottom (isolate 0.152, no thermals): 24.25,30.55 24.25,31.4 24.95,31.4 24.95,30.5 25.7,30.5 25.7,28.95 22.45,28.95 22.45,30.55
VCCDIG18  (via drill 0.3)
  Top 0.3: U1.8 7.95,32.3 v7.5,32.75 C3.1 | U1.42 18.35,32.8 v18.55,32.6 C15.1 | U1.12 v7.5,30.3 | C4.1 7.3,30.8 7.5,30.6 v7.5,30.3 | C7.1 7.3,29.75 7.5,29.95 v7.5,30.3 | C8.1 v11.6,37.41 11.3,37.1 U1.60
  Bottom 0.4: v18.55,32.6 18.55,36.55 17.7,37.41 v11.6,37.41 7.5,37.41 | v7.5,30.3 v7.5,32.75 7.5,37.41 | 7.5,37.41 7.5,38.1 6.2,39.4 C16.1 6,40.05 FB2.2
  pour Bottom (isolate 0.2, no thermals): 4.75,40.25 4.75,36.6 7.1,34.25 7.1,29.9 9.05,29.9 9.05,36.1 17.05,36.1 17.05,32.25 18.75,32.25 18.75,38.4 7.8,38.4 7.8,40.25
VCCDIG33  (via drill 0.3)
  Top 0.3: FB1.1 v20,41.2 | C1.1 C10.1 | C10.1 U1.29 | C10.1 v14.45,26.35
  PWR 0.3: v14.45,26.35 15.25,27.15 19.15,27.15 20,28 v20,41.2 20,49.3 21.7,51 v23,51 34,51 37.5,47.5 v37.5,45.45
  Bottom 0.2: U4.18 12.45,48.95 13.9,50.4 C18.1
  Bottom 0.3: v37.5,45.45 FB3.1 | L1.2 19.8,51 v23,51
  Bottom 1: L1.2 C18.1
  pour Bottom (isolate 0.2, no thermals): 12.45,48.3 12.45,51.55 23.35,51.55 23.35,50 14.4,50 12.7,48.3
  pour PWR (isolate 0.406, no thermals): 14,28 14,24 20,24 21.15,25.15 21.15,47.55 23.6,50 33.3,50 36,47.3 36,44 39,44 39,49 36,52 21,52 17.3,48.3 17.3,29.1 16.2,28
VCCINT  (via drill 0.3)
  Top 0.3: v45.85,44.05 FB5.1
  Bottom 0.3: R20.1 C22.1 44.25,42.12 | 44.25,42.12 44.25,44.05 | C21.1 44.25,44.05 | 44.25,44.05 v45.85,44.05 | U3.6 42.48,41.77 42.83,42.12 R18.2 44.25,42.12
  pour Bottom (isolate 0.2, no thermals): 41,45.2 41,41 43.8,41 43.8,39.95 46.45,39.95 46.45,45.2
XTL_OUT  (via drill 0.3)
  Top 0.2: C31.2 27.2,32.55 27.55,32.9 v29.4,32.9
  Top 0.3: v26.1,46.45 X3.3 C32.2
  PWR 0.3: v29.4,32.9 v29.39,32.9 27.66,32.9 27.11,33.45 23.8,33.45 22.95,34.3 22.95,36.25 24.8,38.1 24.8,44.16 26.1,45.45 v26.1,46.45

### Text on the board
tPlace: RX_ON | SEN_PKT | BH_PKT | FSK_PKT | TX_ON